# EAGLE design CHESCN.PCB (EAGLE 6.6.0)
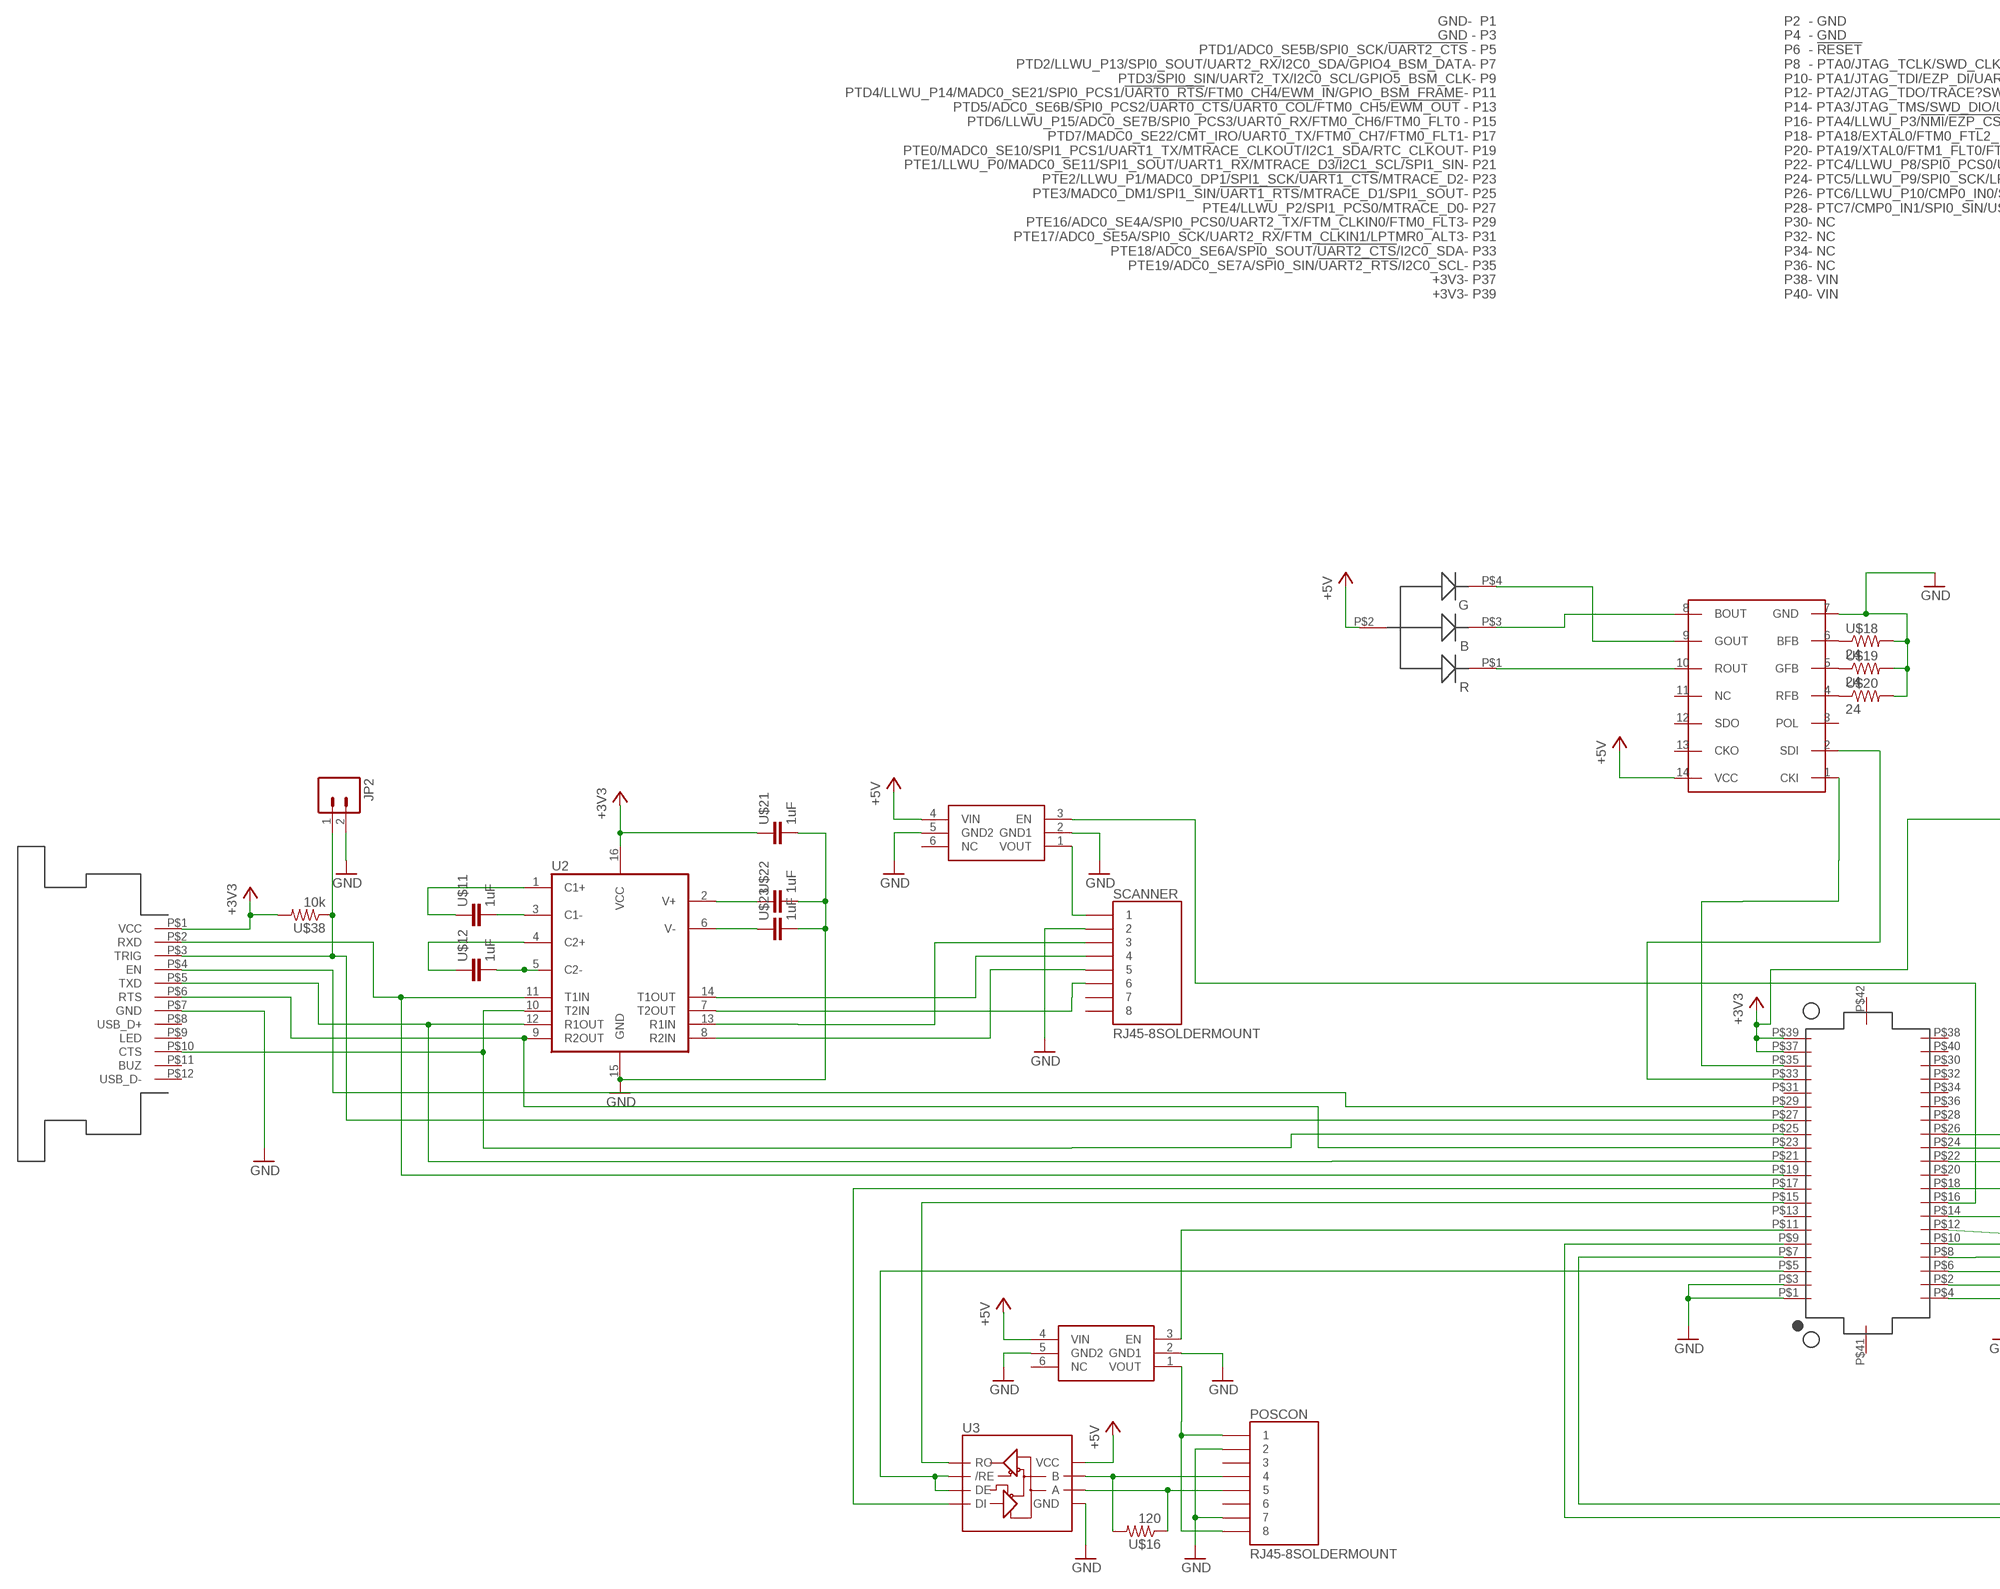
[diagram p0: schematic, sheet 1, part 1 of 2]
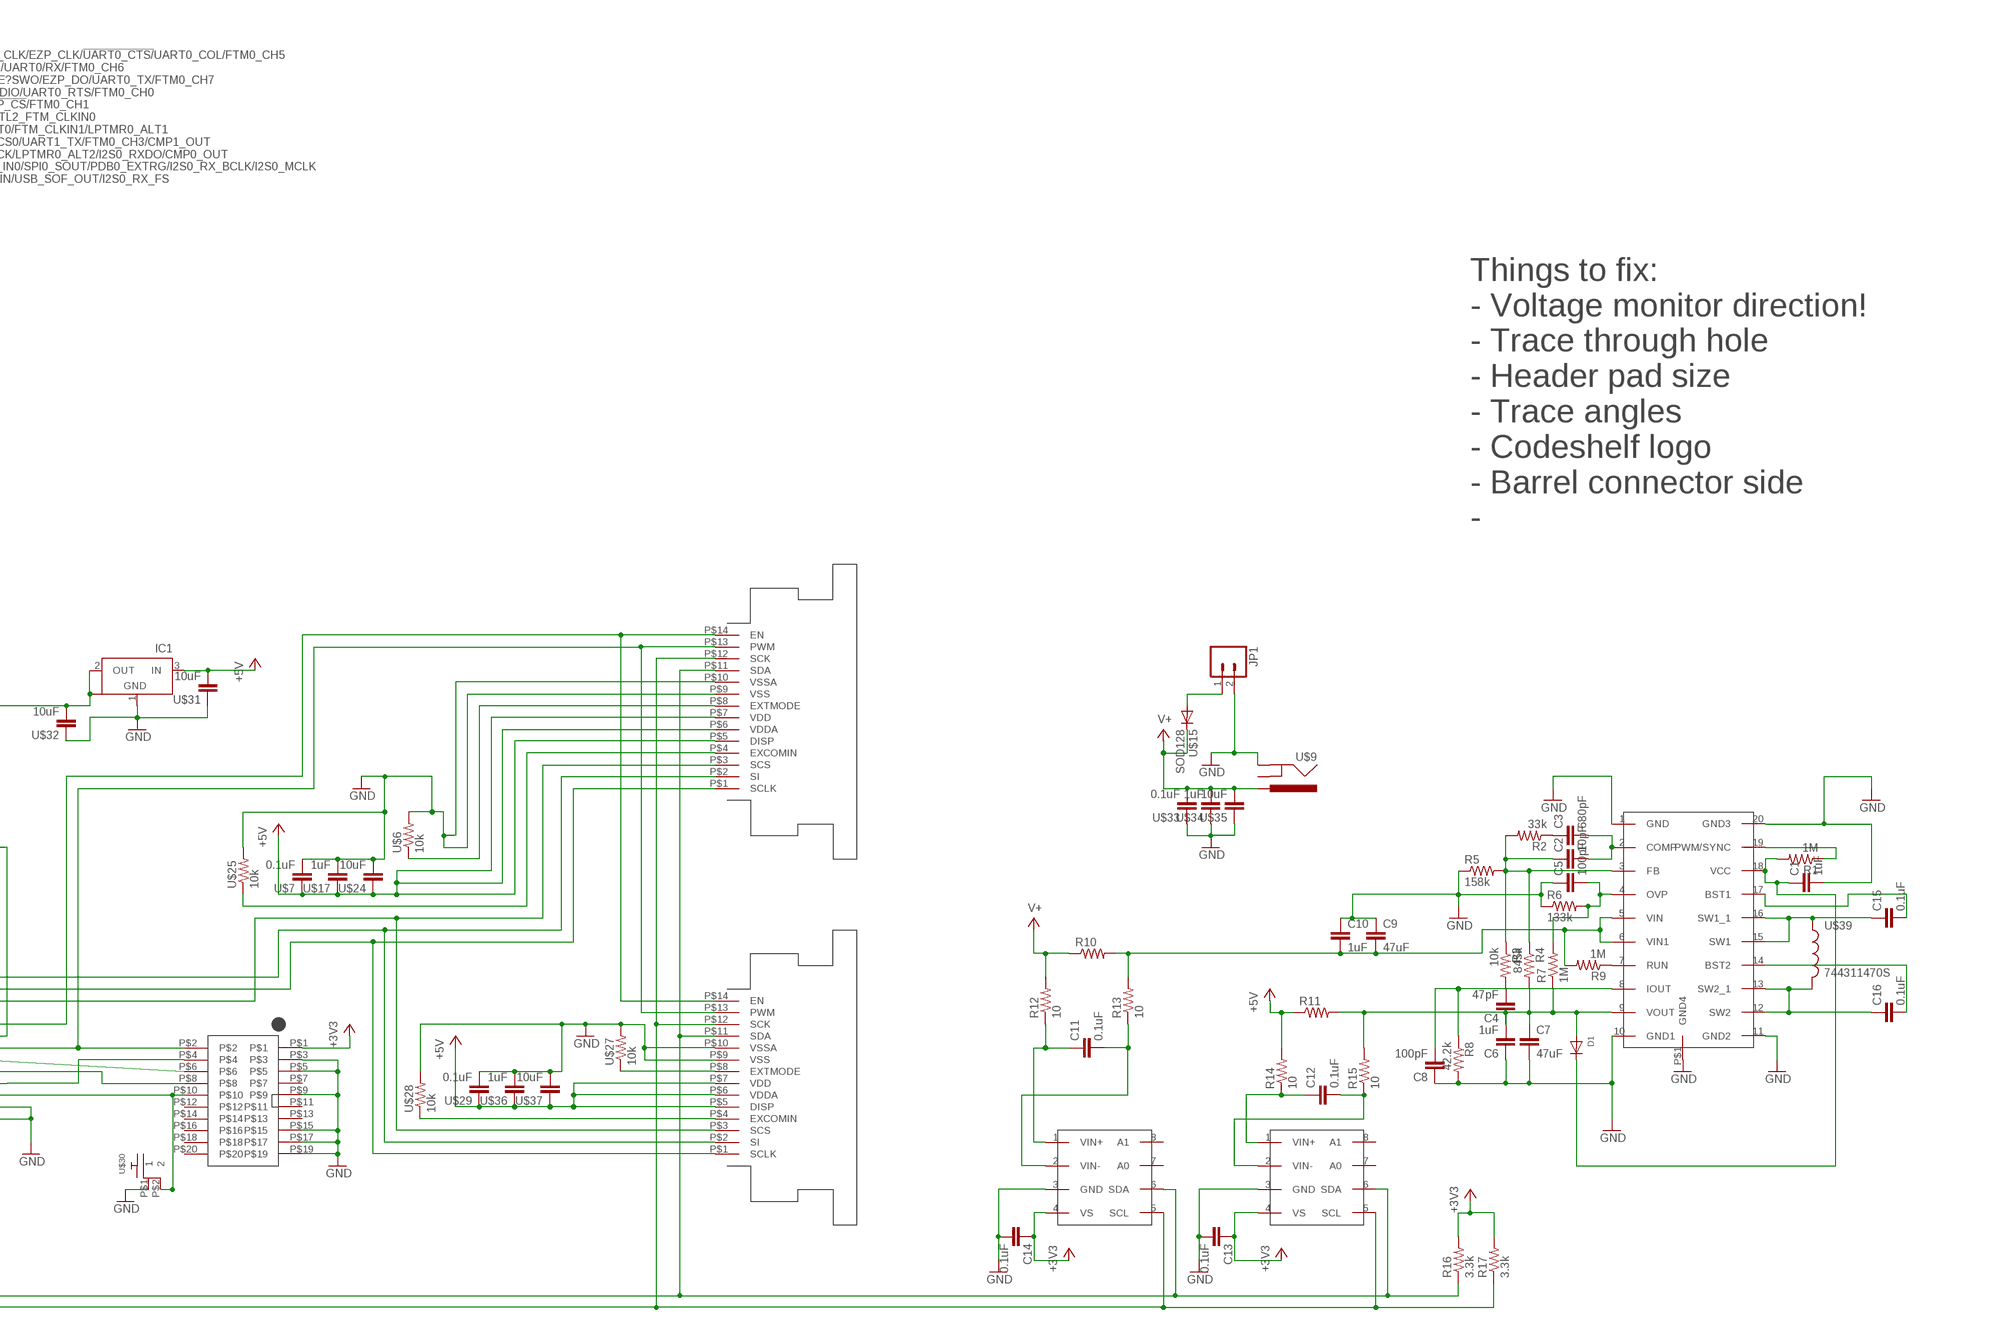
[diagram p1: schematic, sheet 1, part 2 of 2]

## Parts
C1  1uF  RF-C0603  [C0603]
C2  10pF  RF-C0402  [C0402]
C3  680pF  RF-C0402  [C0402]
C4  47pF  RF-C0402  [C0402]
C5  100pF  RF-C0402  [C0402]
C6  1uF  RF-C0603  [C0603]
C7  47uF  RF-C1210  [C1210K]
C8  100pF  RF-C0402  [C0402]
C9  47uF  RF-C1210  [C1210K]
C10  1uF  RF-C0603  [C0603]
C11  0.1uF  RF-C0402  [C0402]
C12  0.1uF  RF-C0402  [C0402]
C13  0.1uF  RF-C0402  [C0402]
C14  0.1uF  RF-C0402  [C0402]
C15  0.1uF  RF-C0402  [C0402]
C16  0.1uF  RF-C0402  [C0402]
D1  DIODESOD-123  [SOD-123]
IC1  NCP1117ST33T3G_1  [SOT223]
JP1  M02POGO_PIN_HOLES_ONLY  [1X02_PP_HOLES_ONLY]
JP2  M02POGO_PIN_HOLES_ONLY  [1X02_PP_HOLES_ONLY]
POSCON  RJ45-8SOLDERMOUNT  [RJLSE4208101T]
R1  1M  RF-R0402  [RF-R0402]
R2  33k  RF-R0402  [RF-R0402]
R3  10k  RF-R0402  [RF-R0402]
R4  845k  RF-R0402  [RF-R0402]
R5  158k  RF-R0402  [RF-R0402]
R6  133k  RF-R0402  [RF-R0402]
R7  1M  RF-R0402  [RF-R0402]
R8  42.2k  RF-R0402  [RF-R0402]
R9  1M  RF-R0402  [RF-R0402]
R10  RF-R2512  [R2512]
R11  RF-R2512  [R2512]
R12  10  RF-R0402  [RF-R0402]
R13  10  RF-R0402  [RF-R0402]
R14  10  RF-R0402  [RF-R0402]
R15  10  RF-R0402  [RF-R0402]
R16  3.3k  RF-R0402  [RF-R0402]
R17  3.3k  RF-R0402  [RF-R0402]
SCANNER  RJ45-8SOLDERMOUNT  [RJLSE4208101T]
U2  MAX232SOIC16  [SO016]
U3  RS485SOIC  [SO08]
U$1  RGLBED  [RGBLED]
U$2  SFV14R-2STE1HLF  [SFV14R-2STE1HLF]
U$3  2X10JTAG  [2X10JTAG]
U$4  MIC94061C6  [SC70-6L]
U$5  MIC94061C6  [SC70-6L]
U$6  10k  RF-R0402  [RF-R0402]
U$7  0.1uF  RF-C0402  [C0402]
U$8  WS2801  [SO14]
U$9  BARREL_CUI_PJ-002A  [BARREL_CUI_PJ-002A]
U$10  DF12_FOLD  [BRAIN_OLD]
U$11  1uF  RF-C0402  [C0402]
U$12  1uF  RF-C0402  [C0402]
U$14  SFV14R-2STE1HLF  [SFV14R-2STE1HLF]
U$15  SOD128  [SOD128]
U$16  120  RF-R0402  [RF-R0402]
U$17  1uF  RF-C0402  [C0402]
U$18  24  RF-R0402  [RF-R0402]
U$19  24  RF-R0402  [RF-R0402]
U$20  24  RF-R0402  [RF-R0402]
U$21  1uF  RF-C0402  [C0402]
U$22  1uF  RF-C0402  [C0402]
U$23  1uF  RF-C0402  [C0402]
U$24  10uF  RF-C0805  [C0805]
U$25  10k  RF-R0402  [RF-R0402]
U$26  SFV12R-1STE1HLF  [SFV12R-1STE1HLF]
U$27  10k  RF-R0402  [RF-R0402]
U$28  10k  RF-R0402  [RF-R0402]
U$29  0.1uF  RF-C0402  [C0402]
U$30  RA_BUTTON  [RA_BUTTON]
U$31  10uF  RF-C0805  [C0805]
U$32  10uF  RF-C0805  [C0805]
U$33  0.1uF  RF-C0402  [C0402]
U$34  1uF  RF-C0402  [C0402]
U$35  10uF  RF-C0805  [C0805]
U$36  1uF  RF-C0402  [C0402]
U$37  10uF  RF-C0805  [C0805]
U$38  10k  RF-R0402  [RF-R0402]
U$39  744311470S  [IHLP4040DZ]
U$44  LTC3112  [TSSOP20]
U$45  INA219B  [DCN-R-PDSO-G8]
U$46  INA219B  [DCN-R-PDSO-G8]

## Nets
+3V3: C13.1 C14.1 IC1.2(OUT) IC1.4(OUT1) R16.2 R17.2 U2.16(VCC) U$3.P$1 U$10.P$37(+3V3) U$10.P$39(+3V3) U$21.1 U$26.P$1(VCC) U$32.2 U$38.2 U$45.4(VS) U$46.4(VS)
+5V: IC1.3(IN) R11.1 R14.2 U3.8(VCC) U$1.P$2(ANODE) U$2.P$5(DISP) U$2.P$6(VDDA) U$2.P$7(VDD) U$4.4(VIN) U$5.4(VIN) U$7.1 U$8.14(VCC) U$14.P$5(DISP) U$14.P$6(VDDA) U$14.P$7(VDD) U$17.1 U$24.1 U$29.1 U$31.2 U$36.1 U$37.1
C1: U2.1(C1+) U$11.1
C2: U2.4(C2+) U$12.1
GND [GND]: C1.2 C5.1 C6.1 C7.2 C8.1 C9.1 C10.1 C13.2 C14.2 IC1.1(GND) JP1.2 JP2.2 POSCON.P$2 POSCON.P$7 R5.1 R6.1 R8.2 SCANNER.P$2 U2.15(GND) U3.5(GND) U$2.P$9(VSS) U$2.P$10(VSSA) U$3.P$3 U$3.P$5 U$3.P$9 U$3.P$15 U$3.P$17 U$3.P$19 U$4.2(GND1) U$4.5(GND2) U$5.2(GND1) U$5.5(GND2) U$6.2 U$7.2 U$8.7(GND) U$9.P$2(GND) U$10.P$1(GND) U$10.P$2(GND) U$10.P$3(GND) U$10.P$4(GND) U$14.P$9(VSS) U$14.P$10(VSSA) U$17.2 U$18.2 U$19.2 U$20.2 U$21.2 U$22.2 U$23.2 U$24.2 U$25.2 U$26.P$7(GND) U$27.2 U$28.2 U$29.2 U$30.P$1 U$31.1 U$32.1 U$33.1 U$34.1 U$35.1 U$36.2 U$37.2 U$44.1(GND) U$44.10(GND1) U$44.11(GND2) U$44.20(GND3) U$44.P$1(GND4) U$45.3(GND) U$46.3(GND)
N$1: U$2.P$13(PWM) U$3.P$2 U$10.P$14(PTA3/JTAG_TMS/SWD_DIO/UART0_RTS/FTM0_CH0) U$14.P$13(PWM)
N$2: U$3.P$6 U$10.P$12(PTA2/JTAG_TDO/TRACE?SWO/EZP_DO/UART0_TX/FTM0_CH7)
N$3: U$3.P$8 U$10.P$10(PTA1/JTAG_TDI/EZP_DI/UART0/RX/FTM0_CH6)
N$4: U$3.P$4 U$10.P$8(PTA0/JTAG_TCLK/SWD_CLK/EZP_CLK/!UART0_CTS/!UART0_COL/FTM0_CH5)
N$5: U$1.P$4(GREEN) U$8.9(GOUT)
N$6: U$3.P$10 U$10.P$6(!RESET) U$30.P$2
N$7: SCANNER.P$6 U2.7(T2OUT)
N$8: U$1.P$3(BLUE) U$8.8(BOUT)
N$9: U$1.P$1(RED) U$8.10(ROUT)
N$10 [GND]: U2.12(R1OUT) U$10.P$21(PTE1/LLWU_P0/MADC0_SE11/SPI1_SOUT/UART1_RX/MTRACE_D3/I2C1_SCL/SPI1_SIN) U$26.P$5(TXD)
N$11: U$8.1(CKI) U$10.P$35(PTE19/ADC0_SE7A/SPI0_SIN/!UART2_RTS!/I2C0_SCL)
N$12 [GND]: SCANNER.P$4 U2.14(T1OUT)
N$13: U$8.6(BFB) U$18.1
N$14: U$8.5(GFB) U$19.1
N$15: U$8.4(RFB) U$20.1
N$16: U$8.2(SDI) U$10.P$33(PTE18/ADC0_SE6A/SPI0_SOUT/!UART2_CTS!/I2C0_SDA)
N$17 [GND]: U3.1(RO) U$10.P$15(PTD6/LLWU_P15/ADC0_SE7B/SPI0_PCS3/UART0_RX/FTM0_CH6/FTM0_FLT0)
N$18: U2.3(C1-) U$11.2
N$19: POSCON.P$4 U3.7(B) U$16.2
N$20: POSCON.P$5 U3.6(A) U$16.1
N$21: U2.5(C2-) U$12.2
N$22: U2.6(V-) U$23.1
N$23: U2.2(V+) U$22.1
N$24: POSCON.P$1 POSCON.P$8 U$5.1(VOUT)
N$25 [GND]: SCANNER.P$1 U$4.1(VOUT)
N$26 [GND]: U2.11(T1IN) U$10.P$19(PTE0/MADC0_SE10/SPI1_PCS1/UART1_TX/MTRACE_CLKOUT/I2C1_SDA/RTC_CLKOUT) U$26.P$2(RXD)
N$27 [GND]: U3.4(DI) U$10.P$17(PTD7/MADC0_SE22/CMT_IRO/UART0_TX/FTM0_CH7/FTM0_FLT1)
N$28 [GND]: U3.2(/RE) U3.3(DE) U$10.P$5(PTD1/ADC0_SE5B/SPI0_SCK/!UART2_CTS)
N$29 [GND]: U$2.P$2(SI) U$10.P$26(PTC6/LLWU_P10/CMP0_IN0/SPI0_SOUT/PDB0_EXTRG/I2S0_RX_BCLK/I2S0_MCLK) U$14.P$2(SI)
N$30 [GND]: U$2.P$1(SCLK) U$10.P$24(PTC5/LLWU_P8/SPI0_PCS0/UART1_TX/FTM0_CH3/CMP1_OUT) U$14.P$1(SCLK)
N$31 [GND]: U$2.P$3(SCS) U$10.P$22(PTC4/LLWU_P8/SPI0_PCS0/UART1_TX/FTM0_CH3/CMP1_OUT) U$14.P$3(SCS)
N$32: C15.1 U$39.P$1 U$44.15(SW1) U$44.16(SW1_1)
N$33 [GND]: U$2.P$4(EXCOMIN) U$25.1
N$34 [GND]: U$2.P$8(EXTMODE) U$6.1
N$35: C16.1 U$39.P$2 U$44.12(SW2) U$44.13(SW2_1)
N$36: C16.2 U$44.14(BST2)
N$37: C15.2 U$44.17(BST1)
N$38: C2.2 C3.2 U$44.2(COMP)
N$39: U$5.3(EN) U$10.P$11(PTD4/LLWU_P14/MADC0_SE21/SPI0_PCS1/!UART0_RTS!/FTM0_CH4/EWM_IN/GPIO_BSM_FRAME)
N$40: U$4.3(EN) U$10.P$16(PTA4/LLWU_P3/!NMI!/!EZP_CS!/FTM0_CH1)
N$41: U2.10(T2IN) U$10.P$25(PTE3/MADC0_DM1/SPI1_SIN/!UART1_RTS!/MTRACE_D1/SPI1_SOUT) U$26.P$10(CTS)
N$42: C3.1 R2.1
N$43: C1.1 D1.C R1.2 U$44.18(VCC)
N$44: R1.1 U$44.19(PWM/SYNC)
N$45: C2.1 R2.2 R3.1 R4.1 R5.2 U$44.3(FB)
N$46: C4.2 R3.2
N$47: C9.2 C10.2 R9.2 R10.2 R13.2 U$44.5(VIN) U$44.6(VIN1)
N$48: C4.1 C6.2 C7.1 D1.A R4.2 R7.1 R11.2 R15.2 U$44.9(VOUT)
N$49: C5.2 R6.2 R7.2 U$44.4(OVP)
N$50: R9.1 U$44.7(RUN)
N$51: C8.2 R8.1 U$44.8(IOUT)
N$52: SCANNER.P$5 U2.8(R2IN)
N$53: C11.1 R12.1 U$45.1(VIN+)
N$54: U2.9(R2OUT) U$10.P$23(PTE2/LLWU_P1/MADC0_DP1/SPI1_SCK/!UART1_CTS!/MTRACE_D2) U$26.P$6(RTS)
N$55: C11.2 R13.1 U$45.2(VIN-)
N$56: C12.1 R14.1 U$46.1(VIN+)
N$57: C12.2 R15.1 U$46.2(VIN-)
N$58: R16.1 U$2.P$11(SDA) U$10.P$7(PTD2/LLWU_P13/SPI0_SOUT/UART2_RX/I2C0_SDA/GPIO4_BSM_DATA) U$14.P$11(SDA) U$45.6(SDA) U$46.6(SDA)
N$59: R17.1 U$2.P$12(SCK) U$10.P$9(PTD3/SPI0_SIN/UART2_TX/I2C0_SCL/GPIO5_BSM_CLK) U$14.P$12(SCK) U$45.5(SCL) U$46.5(SCL)
N$60: JP2.1 U$10.P$27(PTE4/LLWU_P2/SPI1_PCS0/MTRACE_D0) U$26.P$3(TRIG) U$38.1
N$61: U$2.P$14(EN) U$10.P$18(PTA18/EXTAL0/FTM0_FTL2_FTM_CLKIN0) U$14.P$14(EN)
N$62: U$10.P$29(PTE16/ADC0_SE4A/SPI0_PCS0/UART2_TX/FTM_CLKIN0/FTM0_FLT3) U$26.P$4(EN)
N$63 [GND]: U$14.P$4(EXCOMIN) U$28.1
N$64: U$14.P$8(EXTMODE) U$27.1
N$65: JP1.1 U$15.P$2(A)
R1IN: SCANNER.P$3 U2.13(R1IN)
V+: R10.1 R12.2 U$9.P$1(PWR) U$15.P$1(C) U$33.2 U$34.2 U$35.2
Unconnected: POSCON.P$3 POSCON.P$6 SCANNER.P$7 SCANNER.P$8 U$3.P$7 U$3.P$11 U$3.P$12 U$3.P$13 U$3.P$14 U$3.P$16 U$3.P$18 U$3.P$20 U$4.6(NC) U$5.6(NC) U$8.3(POL) U$8.11(NC) U$8.12(SDO) U$8.13(CKO) U$9.P$3(GNDBREAK) U$10.P$13(PTD5/ADC0_SE6B/SPI0_PCS2/!UART0_CTS!/!UART0_COL!/FTM0_CH5/!EWM_OUT) U$10.P$20(PTA19/XTAL0/FTM1_FLT0/FTM_CLKIN1/LPTMR0_ALT1) U$10.P$28(PTC7/CMP0_IN1/SPI0_SIN/USB_SOF_OUT/I2S0_RX_FS) U$10.P$30(NC) U$10.P$31(PTE17/ADC0_SE5A/SPI0_SCK/UART2_RX/FTM_CLKIN1/LPTMR0_ALT3) U$10.P$32(NC) U$10.P$34(NC) U$10.P$36(NC) U$10.P$38(VIN) U$10.P$40(VIN) U$10.P$41 U$10.P$42 U$26.P$8(USB_D+) U$26.P$9(LED) U$26.P$11(BUZ) U$26.P$12(USB_D-) U$45.7(A0) U$45.8(A1) U$46.7(A0) U$46.8(A1)

## Notes on the sheet
- Things to fix:
  - Voltage monitor direction!
  - Trace through hole
  - Header pad size
  - Trace angles
  - Codeshelf logo
  - Barrel connector side
  -

## Library data of the parts
C1-C16 U$7 U$17 U$29 U$33 U$34 U$36 = GW-devices:RF-C: RF capacitor pads for FSL reference design
D1 = adafruit:DIODE: Diode SMADIODE - SMA Surface Mount Package 20V 1A Schottky Diode Digikey: 641-1014-6-ND DO-1N4148 - Through Hole Small Current Diode SOD-123 20V 1 A (.5mV Vf) Schottky Diode - Digikey: MBRX120TPMSCT-ND SOD-323 10V 570mA (.38mV Vf, 3ns) Schottky Diode - Digikey: ZLLS410CT-ND SOD-523 30V 30mA Schottky Diode (RB751S-40TE61) - Digikey: RB751S-40TE61CT-ND SOT23-R/W - SOT23 Package (R = Solder Paste/Reflow Ovens, W = Hand-Soldering) BAT54Film 40V 300mA - Digikey: 497-7162-1-ND
IC1 = KW2:NCP1117ST33T3G_1: VOLTAGE REGULATOR; MFGN: OnSemi; MFGP: NCP1117ST33T3G
JP1 JP2 = SparkFun:M02: Header 2 Standard 2-pin 0.1" header. Use with straight break away headers (SKU : PRT-00116), right angle break away headers (PRT-00553), swiss pins (PRT-00743), machine pins (PRT-00117), and female headers (PRT-00115). Molex polarized connector foot print use with SKU : PRT-08233 with associated crimp pins and housings.
POSCON SCANNER = GW-devices:RJ45-8: RJ45 Jack MFG part number 54602-908lf
R1-R17 U$6 U$25 U$27 U$28 U$38 = GW-devices:RF-R: RF resistor pads for FSL reference design
U2 = SparkFun:MAX232: RS232 Transceiver Very common IC. This is generically called 'MAX232', but works with the 3V equivalent MAX3232 generic ICs. Field tested and mother approved. Spark Fun Electronics SKU : COM-00316 (DIP) and COM-00589 (SMD); MFGN: Texas Instruments; MFGP: MAX232DR; PRICE: 0.86
U3 = SparkFun:RS485; MFGN: Texas Instruments; MFGP: SN65HVD1781DR; PRICE: 4.29
U$1 = KW2:RGLBED
U$2 U$14 = KW2:SFV14R-2STE1HLF
U$3 = KW2:2X10JTAG
U$4 U$5 = GW-devices:MIC94061; MFGN: Micrel; MFGP: MIC94061YC6 TR; PRICE: 1.50
U$8 = GW-devices:WS2801
U$9 = KW2:BARREL_CUI_PJ-002A
U$10 = KW2:DF12_F
U$11 U$12 U$21-U$23 = GW-devices:RF-C: RF capacitor pads for FSL reference design; MFGN: TDK; MFGP: C2012X5R1E105K125AA
U$15 = KW2:SOD128
U$16 = GW-devices:RF-R: RF resistor pads for FSL reference design; MFGN: Vishay Dale; MFGP: CRCW080510K0FKEA
U$18-U$20 = GW-devices:RF-R: RF resistor pads for FSL reference design; MFGN: Vishay Dale; MFGP: CRCW080524R0FKEA
U$24 U$31 U$32 U$35 U$37 = GW-devices:RF-C: RF capacitor pads for FSL reference design; MFGN: Murata; MFGP: GRM219R61E106KA12D
U$26 = KW2:SFV12R-1STE1HLF
U$30 = KW2:RA_BUTTON
U$39 = KW2:744311470
U$44 = linear-technology:LTC3112
U$45 U$46 = texas:INA219B

## Board
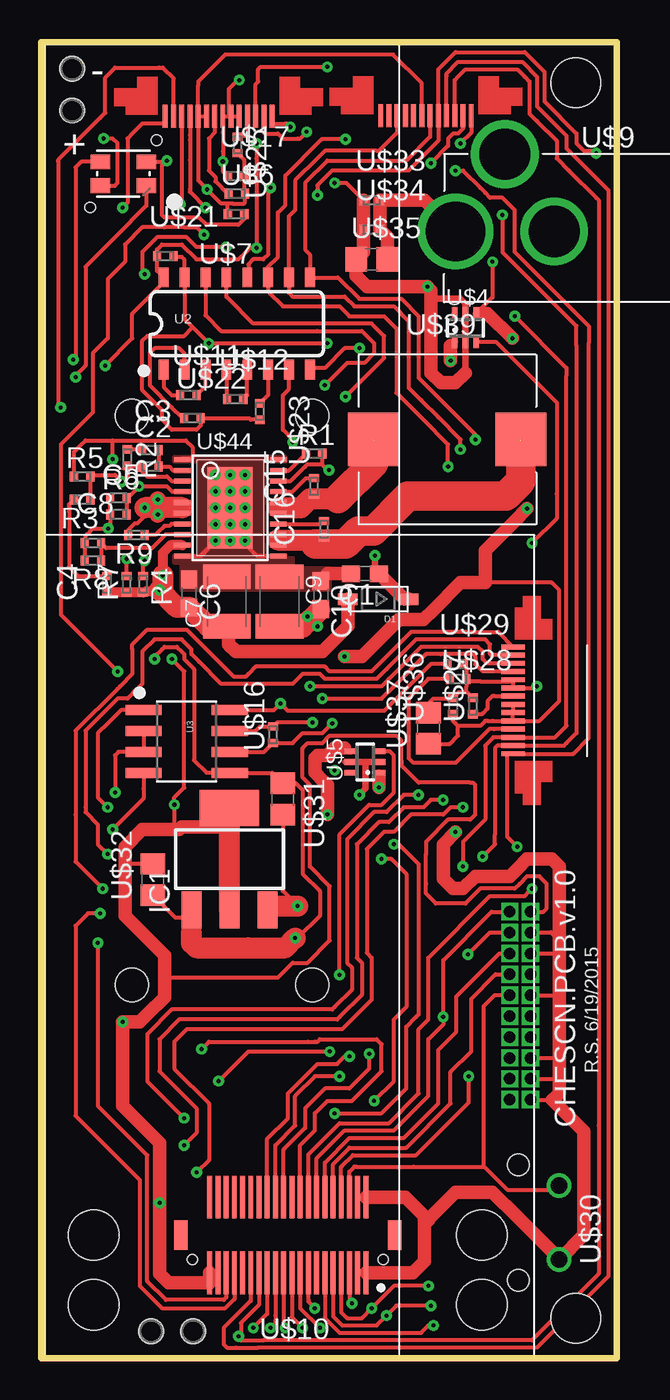
[diagram p2: board, top side]
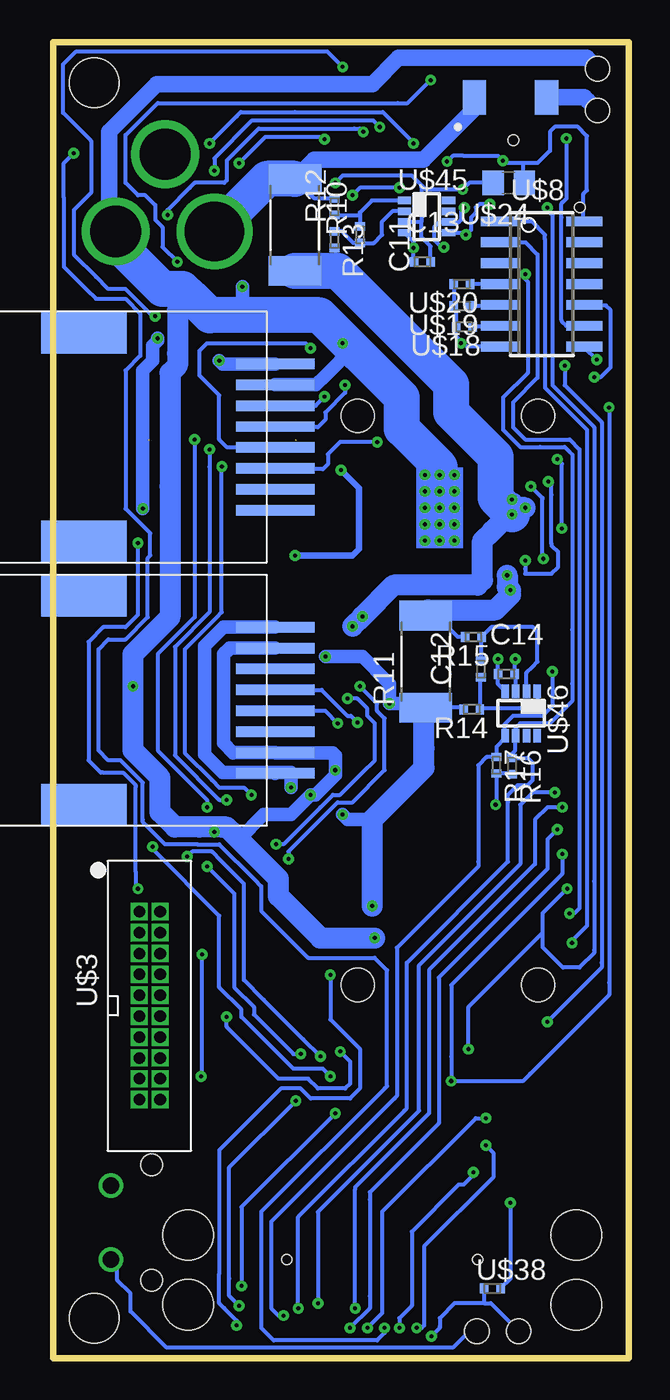
[diagram p3: board, bottom side, seen from below]

Size 35 x 80 mm. Coordinates in mm from the lower left corner, seen from the top.
Outline: 0,80 35,80 35,0 0,0 0,80
Copper layers (1*16): Top 0.035mm / dielectric 1.5mm / Bottom 0.035mm
Design rules "default *": minimum track width 10mil, minimum drill 24mil, track to track 0.15mm, track to pad 0.15mm, pad to pad 0.15mm, via to via 0.15mm, smd to smd 0.15mm, copper to edge 40mil, drill to drill 8mil, minimum pad ring 2mil, minimum via ring 8mil, stop-mask expansion 4mil, vias tented up to drill 0.26mm, thermal gap 10mil
Holes 3.05 mm at 26.8,7.5 3.2,7.5
Holes 3 mm at 32.5,77.55 32.5,2.45

### Footprints (pad centres in the part's own frame; a part is rotated, then mirrored left to right if it is on the bottom)
C0603 = smd 1.1 x 1: 1 -0.85,0; 2 0.85,0
C0402 = smd 0.5 x 0.6: 1 -0.5,0; 2 0.5,0
C1210K = smd 1.5 x 2.9: 1 -1.5,0; 2 1.5,0
SOD-123 = smd 1.2 x 0.7: A 1.85,0; C -1.85,0
SOT223 = smd 1.219 x 2.235: 1 -2.311,-3.099; 2 0,-3.099; 3 2.311,-3.099 | smd 3.6 x 2.2: 4 0,3.099
1X02_PP_HOLES_ONLY = drill 0.889 pad 0.813: 1 0,0; 2 2.54,0 | hole 1.473: 0,0; 2.54,0
RJLSE4208101T = smd 0.635 x 4.75: P$1 -4.445,0; P$2 -3.175,0; P$3 -1.905,0; P$4 -0.635,0; P$5 0.635,0; P$6 1.905,0; P$7 3.175,0; P$8 4.445,0 | smd 2.54 x 5.207: P$9 -6.35,-11.633; P$10 6.35,-11.633
RF-R0402 = smd 0.5 x 0.6: 1 -0.5,0; 2 0.5,0
R2512 = smd 1.8 x 3.2: 1 -2.8,0; 2 2.8,0
SO016 = smd 0.6 x 1.2: 1 -4.445,-2.8; 2 -3.175,-2.8; 3 -1.905,-2.8; 4 -0.635,-2.8; 5 0.635,-2.8; 6 1.905,-2.8; 7 3.175,-2.8; 8 4.445,-2.8; 9 4.445,2.8; 10 3.175,2.8; 11 1.905,2.8; 12 0.635,2.8; 13 -0.635,2.8; 14 -1.905,2.8; 15 -3.175,2.8; 16 -4.445,2.8
SO08 = smd 0.61 x 2.21: 1 -1.905,-2.616; 2 -0.635,-2.616; 3 0.635,-2.616; 4 1.905,-2.616; 5 1.905,2.616; 6 0.635,2.616; 7 -0.635,2.616; 8 -1.905,2.616
RGBLED = smd 1.2 x 0.9: P$1 1.4,-0.725; P$2 1.4,0.725; P$3 -1.4,0.725; P$4 -1.4,-0.725 | hole 0.61: 2.019,2.045; -2.019,-2.045
SFV14R-2STE1HLF = smd 0.3 x 1.4: P$1 -3.25,0; P$2 -2.75,0; P$3 -2.25,0; P$4 -1.75,0; P$5 -1.25,0; P$6 -0.75,0; P$7 -0.25,0; P$8 0.25,0; P$9 0.75,0; P$10 1.25,0; P$11 1.75,0; P$12 2.25,0; P$13 2.75,0; P$14 3.25,0
2X10JTAG = drill 0.7 pad 1 square: P$1 -6.35,-1.27; P$2 -6.35,0; P$3 -5.08,-1.27; P$4 -5.08,0; P$5 -3.81,-1.27; P$6 -3.81,0; P$7 -2.54,-1.27; P$8 -2.54,0; P$9 -1.27,-1.27; P$10 -1.27,0; P$11 0,-1.27; P$12 0,0; P$13 1.27,-1.27; P$14 1.27,0; P$15 2.54,-1.27; P$16 2.54,0; P$17 3.81,-1.27; P$18 3.81,0; P$19 5.08,-1.27; P$20 5.08,0
SC70-6L = smd 0.35 x 0.8: 1 -0.65,-0.85; 2 0,-0.85; 3 0.65,-0.85; 4 0.65,0.85; 5 0,0.85; 6 -0.65,0.85
SO14 = smd 0.6 x 2.2: 1 -3.81,-2.6; 2 -2.54,-2.6; 3 -1.27,-2.6; 4 0,-2.6; 5 1.27,-2.6; 6 2.54,-2.6; 7 3.81,-2.6; 8 3.81,2.6; 9 2.54,2.6; 10 1.27,2.6; 11 0,2.6; 12 -1.27,2.6; 13 -2.54,2.6; 14 -3.81,2.6
BARREL_CUI_PJ-002A = drill 3.6: P$1 0,0 | drill 3.1: P$2 6,0; P$3 3,4.7
BRAIN_OLD = smd 0.3 x 2.6: P$1 -4.75,2.3; P$2 -4.75,-2.3; P$3 -4.25,2.3; P$4 -4.25,-2.3; P$5 -3.75,2.3; P$6 -3.75,-2.3; P$7 -3.25,2.3; P$8 -3.25,-2.3; P$9 -2.75,2.3; P$10 -2.75,-2.3; P$11 -2.25,2.3; P$12 -2.25,-2.3; P$13 -1.75,2.3; P$14 -1.75,-2.3; P$15 -1.25,2.3; P$16 -1.25,-2.3; P$17 -0.75,2.3; P$18 -0.75,-2.3; P$19 -0.25,2.3; P$20 -0.25,-2.3; P$21 0.25,2.3; P$22 0.25,-2.3; P$23 0.75,2.3; P$24 0.75,-2.3; P$25 1.25,2.3; P$26 1.25,-2.3; P$27 1.75,2.3; P$28 1.75,-2.3; P$29 2.25,2.3; P$30 2.25,-2.3; P$31 2.75,2.3; P$32 2.75,-2.3; P$33 3.25,2.3; P$34 3.25,-2.3; P$35 3.75,2.3; P$36 3.75,-2.3; P$37 4.25,2.3; P$38 4.25,-2.3; P$39 4.75,2.3; P$40 4.75,-2.3 | smd 0.8 x 1.8: P$41 -6.5,0; P$42 6.5,0 | hole 0.6: -5.8,1.5; 5.8,1.5 | hole 3.048: -11.8,4.24; 11.8,4.24
18650_1S1P = hole 2: -5.475,17.3; 5.475,17.3; 5.475,-17.3; -5.475,-17.3
SOD128 = smd 1.4 x 2.1: P$1 -2.2,0; P$2 2.2,0
C0805 = smd 1.3 x 1.5: 1 -0.95,0; 2 0.95,0
SFV12R-1STE1HLF = smd 0.3 x 1.4: P$1 -2.75,1.27; P$2 -2.25,1.27; P$3 -1.75,1.27; P$4 -1.25,1.27; P$5 -0.75,1.27; P$6 -0.25,1.27; P$7 0.25,1.27; P$8 0.75,1.27; P$9 1.25,1.27; P$10 1.75,1.27; P$11 2.25,1.27; P$12 2.75,1.27
RA_BUTTON = drill 0.99: P$1 -2.25,0; P$2 2.25,0 | hole 1.3: -3.501,2.49; 3.501,2.49
IHLP4040DZ = smd 3.124 x 3.251: P$1 -4.471,0; P$2 4.471,0
TSSOP20 = smd 0.305 x 0.991: 1 -2.925,-2.918; 2 -2.275,-2.918; 3 -1.625,-2.918; 4 -0.975,-2.918; 5 -0.325,-2.918; 6 0.325,-2.918; 7 0.975,-2.918; 8 1.625,-2.918; 9 2.275,-2.918; 10 2.925,-2.918; 11 2.925,2.918; 12 2.275,2.918; 13 1.625,2.918; 14 0.975,2.918; 15 0.325,2.918; 16 -0.325,2.918; 17 -0.975,2.918; 18 -1.625,2.918; 19 -2.275,2.918; 20 -2.925,2.918 | smd 4.95 x 2.74: P$1 0,0
DCN-R-PDSO-G8 = smd 0.45 x 0.8: 1 -0.975,-1.35; 2 -0.325,-1.35; 3 0.325,-1.35; 4 0.975,-1.35; 5 0.975,1.35; 6 0.325,1.35; 7 -0.325,1.35; 8 -0.975,1.35

### Placement (x,y rotation side)
C1  19.7,47.7 180 top
C2  6.65,54.2 0 top
C3  6.65,55.2 0 top
C4  4,47.05 90 top
C5  4.7,51.3 0 top
C6  9,46.5 270 top
C7  11.3,46 90 top
C8  3.15,49.55 0 top
C9  14.5,46 270 top
C10  17,46.4 270 top
C11  16.35,68.3 270 bottom
C12  9,41.9 90 bottom
C13  12.55,66.65 0 bottom
C14  7.45,41.6 0 bottom
C15  16.6,53 90 top
C16  17.2,50.4 90 top
D1  20.5,46.15 180 top
IC1  11.45,30.35 0 top
JP1  1.9,75.85 90 top
JP2  6.7,1.65 0 top
POSCON  21.5,40 270 bottom
R1  16.6,55 0 top
R2  5.25,54.75 270 top
R3  2.5,52.2 180 top
R4  6.2,47.05 270 top
R5  2.5,53.6 0 top
R6  4.7,52.3 0 top
R7  5.2,47.05 90 top
R8  3.15,48.5 180 top
R9  5.8,50.05 180 top
R10  20.3,68.9 270 bottom
R11  12.35,42.35 90 bottom
R12  17.9,70 90 bottom
R13  17.9,68 270 bottom
R14  9.55,39.45 180 bottom
R15  9.45,43.85 180 bottom
R16  7.1,36 270 bottom
R17  8.05,36.05 270 bottom
SCANNER  21.5,56 270 bottom
U2  11.9,62.9 0 top
U3  8.85,37.5 270 top
U$1  5,72 0 top
U$2  10.8,75.5 180 top
U$3  28.5,20.8 270 bottom
U$4  25.8,62.65 0 top
U$5  19.7,36.25 90 top
U$6  11.9,70.8 0 top
U$7  11.85,69.55 180 top
U$8  5.3,65.3 270 bottom
U$9  25.2,68.5 0 top
U$10  15,7.5 180 top
U$11  8.95,58.55 0 top
U$12  11.8,58.3 0 top
U$13  [18650_1S1P]  11,40 0 top
U$14  28.7,40 90 top
U$15  7.2,76.65 0 bottom
U$16  14.1,37.9 90 top
U$17  11.85,71.85 0 top
U$18  10,62.7 180 bottom
U$19  10.15,63.95 180 bottom
U$20  10.15,65.3 180 bottom
U$21  7.55,67 0 top
U$22  9.2,57.15 0 top
U$23  13.3,57.55 270 top
U$24  7.3,71.45 180 bottom
U$25  11.95,73.75 270 top
U$26  23.4,76.8 180 top
U$27  26.25,39.65 90 top
U$28  25.35,41.3 0 top
U$29  25.2,42.2 0 top
U$30  31.5,8.25 90 top
U$31  14.7,34 270 top
U$32  6.8,29.1 90 top
U$33  20.1,70.4 0 top
U$34  20.1,68.6 0 top
U$35  20.1,66.8 0 top
U$36  25.05,39.65 90 top
U$37  23.55,38.3 90 top
U$38  8.3,4.25 0 bottom
U$39  24.7,55.85 0 top
U$44  11.5,51.7 270 top
U$45  12.3,69.4 270 bottom
U$46  6.55,39.2 180 bottom

### Tracks (layer width: path | path; a pad name or v marks a point on that pad's centre or on a via)
+3V3  (via drill 0.25)
  Top 0.254: U$10.P$37 U$10.P$39 | U$21.1 7.05,66.8 | v13.1,73.85 13.1,72.95 13.1,71.9 13.1,71.7 v13.1,67.5 12.7,67.5 12.45,67.25 12,66.8 9.45,66.8 8.55,67.7 7.35,67.7 7.05,67.4 U$21.1 | 8.25,32 8.1,32.15 v8.1,33.65 8.1,34.1 8.7,34.7 8.7,41.75 v7.95,42.5 | U$32.2 5.33,30.05 5.25,30.05 5.1,29.9 | U$3.P$1 30.55,27.15 30.75,27.35 30.75,28.85 30.3,29.3 29.55,29.3 29.1,28.85 28.8,28.55 26.7,28.55 26.4,28.25 25.8,27.65 24,27.65 23.4,28.25 23.4,28.85 23.4,30.65 23.4,31.4 24.75,32.75 26.1,32.75 26.4,33.05 26.4,34.85 26.25,35 26.1,35 22.95,35 21.9,36.05 21.9,36.35 21.9,37.55 21.82,37.62 21.6,37.85 17.55,37.85 17.1,37.4 16.2,37.4 15.9,37.1 15.9,35.3 16.35,34.85 16.35,29.9 17.55,28.7 17.55,25.4 16.2,24.05 15.3,24.05 14.4,23.15 7.5,23.15 | v3.9,60.35 5.55,62 5.55,63.5 7.46,65.41 U2.16 7.05,66.11 U$21.1 | U$26.P$1 26.15,74.5 v25.5,73.85
  Top 0.813: U$10.P$39 10.25,4.6 7.75,4.6 7.2,5.15 v7.2,9.45 7.2,13.1 4.95,15.35 v4.95,20.45 6,20.45 6.45,20.9 7.5,21.95 7.5,23.15 7.5,24.2 7.5,24.5 5.1,26.9 5.1,29.75 5.1,29.9 5.1,31.1 6.15,32.15 7.8,32.15 | 7.8,32.15 8.1,32.15 | 11.45,32.3 8.55,32.3 8.4,32.15 7.8,32.15
  Top 1.27: IC1.2 11.45,29.3 11.45,32.3 IC1.4
  Bottom 0.254: R16.2 7.15,35.55 R17.2 8.05,33.7 v8.1,33.65 | 7.95,41.58 C14.1 | U$46.4 7.95,40.98 C14.1 | C14.1 v7.95,42.5 | U$45.4 13.1,67.88 v13.1,67.5 13.1,66.7 C13.1 | v4.95,20.45 1.65,23.75 1.65,24.05 1.65,56.9 3.9,59.15 v3.9,60.35 | v25.5,73.85 23.85,75.5 23.6,75.75 20.3,75.75 14.95,75.75 14.7,75.5 13.52,74.33 13.1,73.9 v13.1,73.85 | v7.2,9.45 7.2,4.85 U$38.2
+5V  (via drill 0.25)
  Top 0.254: U$2.P$6 U$2.P$7 11.05,74.5 11.05,73.35 v11.05,72.75 11.05,72.15 U$17.1 | U$2.P$6 U$2.P$5 | U$1.P$2 7.57,72.72 v7.65,72.8 7.35,72.5 7.35,69.5 7.5,69.35 9.6,69.35 10.05,68.9 12,68.9 12.35,69.25 U$7.1 | U$14.P$7 U$14.P$6 U$14.P$5 | U$14.P$5 27.45,38.75 27.15,38.75 27,38.75 26.7,38.45 25.35,38.45 | U$14.P$5 30.3,38.75 31.5,39.95 31.5,46.7 31.05,47.15 27,47.15 | U$2.P$6 11.4,75.65 11.4,77.15 11.95,77.7 v12.05,77.7 | 25.35,38.45 25.2,38.6 25.05,38.75 U$36.1 | U$37.1 24.85,37.35 25.35,37.85 25.35,38.45 | U$29.1 23.7,42.2 21.75,40.25 20.85,39.35 17.55,39.35 15,39.35 v14.55,39.8 14.16,39.41 U3.8 | U$31.2 14.7,28.4 v15.6,27.5 | IC1.3 13.76,26.79 13.8,26.75 13.8,27.49 13.81,27.5 | v27.45,66.65 27.45,64.5 U$4.4
  Top 0.406: U$4.4 26.7,63.5 | U$5.4 18.65,36.9 18.45,37.1
  Top 0.813: v29.55,51.65 28.8,50.9 27,49.1 27,47.15 25.5,47.15 23.85,45.5 23.25,44.9 21.75,44.9 19.5,42.65 v18.45,42.65 | 17.4,34.85 17.18,35.08 | 17.18,35.08 16.65,35.6 16.65,36.5 16.8,36.65 17.4,36.65 17.55,36.8 17.85,37.1 18.45,37.1 | v17.4,33.05 17.4,34.85 | 17.4,34.85 17.18,35.08 | v28.65,62 27.15,63.5 26.7,63.5
  Top 1.27: 13.81,27.5 14.85,27.5 v15.6,27.5
  Bottom 0.254: U$8.14 2.76,69.05 2.76,70.79 2.55,71 2.55,74.3 3.1,74.85 4.5,74.85 4.8,74.55 4.8,73.4 5.55,72.65 6.45,72.65 | 6.45,72.65 7.5,72.65 v7.65,72.8 7.95,73.1 10.05,73.1 10.7,73.1 v11.05,72.75 | 6.45,72.65 6.45,71.55 U$24.1 | R14.2 10.15,39.55 R11.1 | v27.45,66.65 28.35,67.55 28.35,68.75 28.8,69.2 28.8,70.1 29.4,70.7 29.85,70.7 30.6,71.45 30.6,74.35 28.65,76.3 14.05,76.3 13.45,76.3 v12.05,77.7
  Bottom 0.813: v18.45,42.65 16.5,42.65 16.2,42.65 14.7,41.15 14.55,41 v14.55,39.8 12.6,39.8 R11.1 | v28.65,62 28.65,61.85 28.95,61.55 28.95,60.65 29.55,60.05 29.55,52.25 v29.55,51.65 | v17.4,33.05 17.1,32.75 15.6,32.75
  Bottom 1.27: v15.6,27.5 15.6,27.65 15.6,32.75 12.45,35.9 12.45,37.1 12.45,39.45 R11.1
C1
  Top 0.254: U2.1 7.46,59.05 7.95,58.55 U$11.1
C2
  Top 0.254: U$12.1 11.3,60.06 U2.4
GND  (via drill 0.25)
  Top 0.254: C5.1 R6.1 | C5.1 4.1,51.3 | R5.1 2,55.1 2.4,55.5 2.7,55.8 4.34,55.8 | 4.34,55.8 8.8,55.8 9.2,55.4 9.2,54.7 8.6,54.7 | 9.7,48.8 v10.6,49.7 | v12.4,49.7 12.4,49.5 13.1,48.8 14.39,48.8 U$44.11 | 31.5,25.25 31.5,25.4 31,25.9 29.79,25.9 U$3.P$3 | 31.2,15.8 31.1,15.7 29.79,15.7 U$3.P$19 | 31.5,18.2 31.4,18.3 31.36,18.26 U$3.P$15 | 31.5,24.5 31.4,24.6 U$3.P$5 | U$10.P$2 U$10.P$4 | U$10.P$1 U$10.P$3 | U$2.P$10 U$2.P$9 | 19.35,70.4 U$33.1 18.55,71.45 v17.85,71.45 | 8.05,66.97 U$21.2 8.1,66.95 8.55,66.95 8.73,66.78 U2.15 8.73,63.17 9.23,62.67 | U$2.P$10 9.55,71.9 9.55,71.6 v10.1,71.05 10.95,70.2 11.4,70.2 | 11.4,70.2 11.65,70.2 12.35,70.2 12.4,70.25 U$6.2 12.35,70.85 U$17.2 12.35,72.85 U$25.2 | U$7.2 11.35,70.15 11.4,70.2 | 9.23,62.67 10.13,61.78 v10.2,61.7 15.3,61.7 v17.4,61.7 | U$28.2 25.85,40.8 25.85,40.55 25.9,40.5 | 9.23,62.67 8.7,62.15 6.45,62.15 6.15,61.85 6.15,58.85 7.35,57.65 7.35,57.05 7.95,56.45 9.45,56.45 9.7,56.7 U$22.2 12.65,57.15 12.75,57.05 U$23.2 | C5.1 4.2,50.58 v4.07,50.45 3.15,50.45 3,50.3 2.7,50 2.7,49.6 C8.1 R8.2 | U$44.1 8.55,54.65 | U$3.P$17 31.5,17 | U$3.P$9 31.38,22.07 31.5,21.95 | U$27.2 25.9,40.5 | 25.9,40.5 25.4,40.5 U$36.2 25,40.1 23.85,40.1 23.55,39.8 U$37.2 | U$28.2 26,41.15 26.7,41.15 28.6,41.15 U$14.P$10 U$14.P$9 29.9,40.75 30.05,40.75 v30.15,40.85 | U$29.2 25.85,42.05 U$28.2 | U$32.1 8.15,26.8 8.69,26.8 IC1.1 arc-90 IC1.1 9.15,26.79 9.15,25.89 | v6.9,42.5 6.9,42.65 7.35,43.1 7.5,43.25 8.25,43.25 8.55,42.95 8.7,42.8 8.7,42.5 9.3,41.9 9.3,36.35 10.05,35.6 U3.5 14.05,35.59 U$31.1 15.5,34.95 15.9,34.55 15.9,29.45 16.95,28.4 16.95,26.9 15.6,25.55 v15.45,25.55
  Top 0.254: U$44.10 9.73,48.77 9.75,48.8 10.65,49.7 | v4.35,54.65 4.35,55.79 4.34,55.8 | U$2.P$10 9.55,77.4 9.55,77.6 11.2,79.25 17.9,79.25 21.4,79.25 23.15,77.5 U$26.P$7 | 23.1,8.8 23.3,8.6 23.1,8.8
  Top 0.406: 25.8,59.9 U$4.2 U$4.5 25.8,64.1 25.5,64.4 23.55,64.4 | U$5.2 19.73,36.25 | 19.73,36.25 U$5.5 18.5,36.25 | 19.73,36.25 19.73,34.63 v19.35,34.25
  Top 0.813: U$33.1 U$34.1 19.6,67.3 19.6,67.25 U$35.1 19.15,65.8 19.8,65.15 v23.5,65.15 23.5,65.1 23.7,64.9 23.7,59.9 24.3,59.3 24.9,59.3 25.2,59.3 25.8,59.9 | C1.2 17.4,47.7 | 31.2,15.8 31.5,16.1 31.5,17 31.5,18.2 31.5,21.95 31.5,22.1 31.5,24.5 31.5,25.25 31.5,29.9 31.05,30.35 29.55,30.35 28.95,29.75 28.5,29.3 26.4,29.3 25.65,28.55 25.05,28.55 24.45,29.15 24.45,31.25 v25.2,32 | U$10.P$2 22,9.8 22.15,9.8 23.55,8.4 | 23.55,8.4 23.4,8.4 23.35,8.4 23.3,8.45 | U$10.P$1 22.5,5.2 22.6,5.2 23.3,5.9 23.3,8.45 | 23.3,8.45 23.3,8.6 | 31.1,15.7 33,13.8 33,7.55 33,7.5 U$30.P$1 31.5,6.05 28.95,8.6 27.45,10.1 25.2,10.1 24.9,9.8 23.55,8.45 23.55,8.4
  Top 1.27: 9.15,25.89 9.15,25.25 9.45,24.95 12.6,24.95 14.85,24.95 v15.45,25.55
  Bottom 0.254: 12.6,69.1 12.6,71.15 12.6,71.3 12.68,71.38 | U$24.2 9.7,71.45 v10.1,71.05 12.1,71.05 12.35,71.05 12.68,71.38 | U$20.2 U$19.2 10.5,63.8 U$18.2 10.5,62.15 10.13,61.78 | U$8.7 9.84,61.49 10.13,61.78 | v10.2,61.7 10.13,61.78 | 17.93,62.53 17.93,62.38 17.55,62 | 21.48,36.8 POSCON.P$7 | U$46.3 6.88,41.52 C14.2 6.95,42.15 6.95,42.45 v6.9,42.5 | v30.15,40.85 30.15,41 | U$45.3 13.63,69.1 12.6,69.1 | C13.2 12.05,67.6 12.6,68.15 12.6,69.1 | 12.68,71.38 13.05,71.75 13.2,71.9 17.4,71.9 v17.85,71.45 | v4.07,50.45 4.07,54.37 v4.35,54.65 | v25.2,32 24.97,32.23 arc45 24.79,32.3 24.45,32.3 | v17.4,61.7 17.25,61.7 17.18,61.78 | 25.49,63.4 25.25,63.4 arc-90 v23.5,65.15 | JP2.2 9.7,1.65 10.7,0.65 28.1,0.65 30.3,2.85 30.3,3.95 31.1,4.75 31.1,5.6 U$30.P$1
  Bottom 0.813: v23.5,65.15 23.5,64 | SCANNER.P$2 19.43,59.17 19.02,59.17 18.45,59.75 16.8,61.4 | 21.48,36.8 18.6,36.8 18,36.8 17.85,36.65 v17.85,35.75 17.85,35.45 18,35.3 19.05,34.25 v19.35,34.25 20.55,33.05 22.2,33.05 23.7,31.55 | POSCON.P$7 24.02,36.83 24.05,36.8 24.65,37.4 24.65,42.8 24.35,43.1 24.27,43.17 POSCON.P$2
  Bottom 1.016: U$9.P$2 31.6,68.9 31.6,74.55 28.7,77.45 15.6,77.45 14,79.05 3.8,79.05 2.56,79.05 JP1.2
  Bottom 1.27: 26.62,64.53 27.45,63.71 27.45,61.1 27.45,60.35 27.9,59.9 27.9,53 27.9,45.05 30.15,42.8 30.15,42.35 30.15,41 v30.15,40.85 30.15,36.95 28.5,35.3 28.5,33.35 28.5,33.2 27.6,32.3 26.1,32.3 | v15.45,25.55 16.65,25.55 18.75,25.55 19.35,26.15 21.3,28.1 21.3,29.15 23.7,31.55 24.15,32 24.45,32.3 26.1,32.3 | 24.75,32.3 26.1,32.3
  Bottom 2.184: U$44.P$1 11.5,54.2 13.8,56.5 13.8,58.4 16.4,61 | 16.5,61.1 16.8,61.4 17.1,61.7 17.18,61.78 17.93,62.53 18.8,63.4 25.49,63.4 26.62,64.53 26.68,64.53 27.15,65 28.35,65 31.05,67.7 31.2,67.85 U$9.P$2 | 16.5,61.1 16.4,61 | 16.4,61 16.5,61.1
  other vias: 11.5,51.7 10.6,53.7 11.5,53.7 12.4,53.7 10.6,52.7 11.5,52.7 12.4,52.7 10.6,51.7 12.4,51.7 10.6,50.7 11.5,50.7 12.4,50.7 11.5,49.7
  pour Top (no thermals): 8.1,54.8 14.85,54.8 14.85,54.5 13.5,54.5 13.51,48.8 14.86,48.8 14.85,48.65 15.3,48.65 15.3,48.05 17.55,48.05 17.55,46.7 8.55,46.7 8.55,48.35 8.1,48.35 8.1,48.8 9.6,48.8 9.6,54.5 8.1,54.5
N$1  (via drill 0.25)
  Top 0.254: U$2.P$13 8.05,77.75 8.05,77.8 7.4,78.45 7.2,78.45 4.5,78.45 3.9,77.85 3.9,75.7 3.6,75.4 1.05,72.85 | 1.05,72.7 1.05,72.85 | 1.05,72.85 1.05,72.7 | 1.05,72.7 1.05,62.45 1.05,57.95 v1.2,57.8 | U$14.P$13 27.8,42.75 27.35,42.75 27.3,42.8 27.3,43.4 27,43.7 23.85,43.7 22.8,43.7 21,41.9 20.4,41.3 17.25,41.3 16.95,41.6 15.9,41.6 15.3,41 10.95,41 9.6,42.35 9.15,42.8 9.15,43.1 8.55,43.7 6.9,43.7 6.15,42.95 6.15,41 5.55,40.4 5.4,40.25 5.25,40.1 4.65,40.1 4.5,39.95 3.3,38.75 2.7,38.15 2.7,33.5 2.7,33.2 3.45,32.45 3.45,31.25 v4.05,30.65 | U$10.P$14 16.75,12.15 18.45,13.85 21.45,13.85 23.55,15.95 23.55,19.4 24.45,20.3 v24.45,20.75 24.45,24.2 27.3,27.05 27.4,27.15 U$3.P$2 | v10.8,16.85 12.6,18.65 v17.55,18.65 | 1.05,72.85 1.05,72.7
  Bottom 0.254: v1.2,57.8 1.2,22.85 1.2,22.1 6,17.3 6.45,16.85 v10.8,16.85 10.8,18.35 10.8,22.7 4.05,29.45 v4.05,30.65 | v17.55,18.65 16.95,18.05 16.95,16.7 17.25,16.4 18.9,16.4 19.5,17 21.3,17 24.45,20.15 v24.45,20.75
N$2
  Top 0.254: U$10.P$12 17.25,11.9 18.75,13.4 22.05,13.4 24.15,15.5 24.15,18.75 25.25,19.85 25.25,22 27.75,24.5 27.86,24.61 U$3.P$6
N$3
  Top 0.254: U$10.P$10 17.75,11.8 18.75,12.8 22.2,12.8 24.9,15.5 24.9,17.4 26.15,18.65 26.15,21.85 27.6,23.3 27.64,23.34 U$3.P$8
N$4  (via drill 0.25)
  Top 0.254: v26,17.15 26,15.55 22.8,12.35 18.95,12.35 18.3,11.7 18.25,11.65 U$10.P$8 | v25.95,24.55 27.28,25.88 U$3.P$4
  Bottom 0.254: v26,17.15 25.95,17.2 v25.95,24.55
N$5  (via drill 0.25)
  Top 0.254: U$1.P$4 4.48,71.28 4.65,71.45 4.65,73.85 4.35,74.15 v3.8,74.15
  Bottom 0.254: U$8.9 3.81,62.76 4.1,63.05 4.1,63.1 4.1,69.35 4.1,70.2 4.05,70.25 3.8,70.5 v3.8,74.15
N$6
  Top 0.254: 26.9,11.75 26.9,21.4 27.57,22.07 U$3.P$10 | U$10.P$6 18.75,11.35 19.05,11.65 19.15,11.65 22.65,11.65 26.9,11.65 26.9,11.75 | 26.9,11.75 26.9,11.7 28.35,10.25 31.25,10.25 U$30.P$2
N$7  (via drill 0.25)
  Top 0.254: v15.3,55.7 15.3,55.85 14.7,56.45 14.7,58.55 15,58.85 15.07,58.92 U2.7
  Bottom 0.254: v15.3,55.7 17.55,55.7 18.3,54.95 18.3,54.35 18.6,54.05 21.46,54.05 SCANNER.P$6
N$8  (via drill 0.25)
  Top 0.254: U$1.P$3 2.43,72.72 2.1,72.4 2.1,60.85 v1.95,60.7
  Bottom 0.254: U$8.8 2.7,61.45 v1.95,60.7
N$9  (via drill 0.25)
  Top 0.254: U$1.P$1 6.4,70.05 4.5,68.15 2.7,66.35 2.7,60.35 2.1,59.75 v2.1,59.65
  Bottom 0.254: v2.1,59.65 1.7,59.65 1.1,60.25 1.1,63.7 1.4,64 2.6,64 2.67,64 U$8.10
N$10  (via drill 0.25)
  Top 0.254: v16.8,70.7 16.8,71 16.8,71.3 17.7,72.2 22.35,72.2 24.15,74 U$26.P$5 24.15,78.2 24.15,78.35 25.2,79.4 29.4,79.4 30.6,78.2 30.6,76.4 32.55,74.45 32.55,73.85 33,73.4 33.6,73.4 v33.75,73.25 | v13.95,71.15 13.8,71 13.8,67.1 13.5,66.8 12.9,66.8 12.6,66.5 12.6,65.77 U2.12 | U$10.P$21 14.75,1.95 v14.85,1.85
  Bottom 0.254: v13.95,71.15 16.35,71.15 v16.8,70.7 | v14.85,1.85 14.85,1.55 15.3,1.1 21.6,1.1 22.35,1.85 22.35,8.9 14.83,16.42 14.71,16.54 14.71,23.59 15.46,24.35 19.5,24.35 22.35,27.2 22.35,27.95 22.35,28.7 22.8,29.15 24.9,31.25 26.25,31.25 28.2,31.25 29.55,32.6 29.55,32.75 29.55,35 30.9,36.35 31.05,36.35 31.65,36.35 32.25,36.95 32.25,43.1 31.65,43.7 30.6,43.7 29.25,45.05 29.25,48.65 29.1,48.8 29.1,50.15 30.6,51.65 30.6,60.05 29.7,60.95 29.7,63.5 30.6,64.4 30.9,64.4 32.4,64.4 33,65 34.35,66.35 34.35,70.55 34.35,72.65 v33.75,73.25
N$11  (via drill 0.25)
  Top 0.254: U$10.P$35 11.25,3.7 11.1,3.55 7.6,3.55 6.45,4.7 6.45,12.35 3.45,15.35 v3.45,25.25
  Bottom 0.254: U$8.1 5.91,69.11 5.1,68.3 5.1,68 5.1,59.75 5.1,59 2.55,56.45 2.55,28.7 2.55,26.3 3.45,25.4 v3.45,25.25
N$12  (via drill 0.25)
  Top 0.254: U2.14 9.99,63.41 10.95,62.45 16.8,62.45 19.5,62.45 20.25,61.7 20.25,61.1 19.65,60.5 18.6,60.5 v17.25,59.15
  Bottom 0.254: v17.25,59.15 17.25,58.7 18.45,57.5 18.45,57.05 18.9,56.6 21.46,56.6 SCANNER.P$4
N$13
  Bottom 0.254: U$8.6 7.96,62.7 U$18.1
N$14
  Bottom 0.254: U$8.5 7.98,63.95 U$19.1
N$15
  Bottom 0.254: U$8.4 U$20.1
N$16  (via drill 0.25)
  Top 0.254: v3.6,27.05 2.85,27.05 2.1,26.3 2.1,14.75 6,10.85 6,4.4 7.35,3.05 11.2,3.05 11.55,3.4 | 11.55,3.4 11.7,3.55 | U$10.P$33 11.75,3.6 11.55,3.4
  Bottom 0.254: U$8.2 6.29,67.84 5.55,67.1 5.55,59.75 5.55,59.6 7.05,58.1 7.05,56.6 6.3,55.85 3.6,55.85 3,55.25 3,27.35 3.3,27.05 v3.6,27.05
N$17  (via drill 0.25)
  Top 0.254: U3.1 4.85,39.41 4.05,38.6 3.45,38 3.45,34.1 v4.05,33.5 | U$10.P$15 16.25,3.6 16.25,3.44 v16.64,3.05
  Bottom 0.254: v4.05,33.5 4.95,33.5 5.7,32.75 5.7,30.05 12.15,23.6 12.15,14.9 16.64,10.41 16.64,10.28 v16.64,3.05
N$18
  Top 0.254: U$11.2 9.99,59.09 U2.3
N$19  (via drill 0.25)
  Top 0.254: v16.5,38.65 14.35,38.65 U$16.2 13.3,38.4 13.2,38.3 13.04,38.13 U3.7
  Bottom 0.254: POSCON.P$4 18.68,40.63 17.1,39.05 16.9,39.05 v16.5,38.65
N$20  (via drill 0.25)
  Top 0.254: U3.6 13.57,36.87 U$16.1 15.3,37.4 15.9,38 17.1,38 v17.7,38.6
  Bottom 0.254: POSCON.P$5 18.46,39.37 v17.7,38.6
N$21
  Top 0.254: U$12.2 12.54,58.53 U2.5
N$22
  Top 0.254: U2.6 13.8,58.56 U$23.1
N$23
  Top 0.254: U$22.1 8.6,57.15 7.95,57.8 6.6,59.15 6.6,59.45 6.6,60.8 6.6,61.1 6.9,61.4 8.4,61.4 8.73,61.08 U2.2
N$24  (via drill 0.25)
  Top 0.406: 20.55,35.3 U$5.1
  Top 0.813: v20.55,34.7 20.55,35.3
  Bottom 0.254: 21.5,35.6 POSCON.P$8
  Bottom 0.813: 21.5,35.6 24.7,35.6 25.8,36.7 25.8,43.3 24.66,44.45 POSCON.P$1 | v20.55,34.7 U$5.1 21.46,35.6 POSCON.P$8
N$25  (via drill 0.25)
  Top 0.406: U$4.1 24.9,61.55
  Top 0.813: 24.9,61.55 v24.9,60.65
  Bottom 0.813: SCANNER.P$1 24.7,60.44 v24.9,60.65
N$26  (via drill 0.25)
  Top 0.254: U$10.P$19 15.25,2.5 v15.9,1.85 | v22.95,34.25 22.05,34.25 21,33.2 20.25,33.2 18.6,31.55 18.6,24.05 18.9,23.75 18.9,22.4 17.85,21.35 17.7,21.2 7.95,21.2 6.45,19.7 6.45,16.85 v8.7,14.6 | U$26.P$2 25.65,74.75 25.5,74.6 25.35,74.45 25.05,74.45 24.75,74.15 24.75,73.7 v23.7,72.65 | v18.5,74.1 17.05,74.1 17,74.05 14.85,71.9 14.85,70.1 14.4,69.65 14.4,66.95 13.8,66.36 U2.11 13.8,64.84 14.7,63.95 18.15,63.95 18.75,63.35 20.85,63.35 21.6,62.6 21.6,58.7 23.25,57.05 24.75,55.55 v24.75,54.2
  Bottom 0.254: v23.7,72.65 22.65,73.7 22.1,74.25 19.2,74.25 18.65,74.25 v18.5,74.1 | v22.95,34.25 23.4,34.7 23.85,34.7 24.9,34.7 25.35,35.15 27,36.8 27,43.1 25.05,45.05 24.75,45.35 v24.75,54.2 | v15.9,1.85 15,2.75 15,3.35 15,8.9 9.3,14.6 v8.7,14.6
N$27  (via drill 0.25)
  Top 0.254: U3.4 6.23,34.63 6.23,34.03 v4.35,32.15 | U$10.P$17 15.75,3.35 15.75,3.05 v16.95,1.85
  Bottom 0.254: 15.75,10.1 15.75,9.65 | 15.75,9.65 15.75,3.8 15.75,3.05 v16.95,1.85 | v4.35,32.15 4.95,31.55 4.95,29.75 11.55,23.15 11.55,14.3 15.75,10.1 | 15.75,10.1 15.75,9.65
N$28  (via drill 0.25)
  Top 0.254: U3.2 U3.3 4.71,36.87 4.5,36.65 v4.5,34.4 | 18.75,3.35 v18.9,3.35 18.75,3.35 | U$10.P$5 18.75,3.35
  Bottom 0.254: v18.9,3.35 18.9,8.9 12.75,15.05 12.75,23.9 6.6,30.05 6.6,33.65 5.85,34.4 v4.5,34.4
N$29  (via drill 0.25)
  Top 0.254: U$2.P$2 13.55,74.5 13.6,74.45 14.4,74.45 14.7,74.15 15.6,74.15 15.75,74.15 v16.15,74.55 | U$10.P$26 13.75,13.35 15,14.6 15,16.1 16.8,17.9 18,17.9 18.45,18.35 v18.75,18.35 | v28.05,69.5 28.05,67.25 32.55,62.75 32.55,61.55 32.55,38 31.95,37.4 31.8,37.25 U$14.P$2 27.9,37.25 27.75,37.25 27.6,37.1 27.6,31.85 27.6,31.25 v26.85,30.5
  Bottom 0.254: v28.05,69.5 28.05,69.8 26.7,71.15 26.4,71.45 24.6,71.45 24.45,71.6 24.45,72.05 24.45,72.8 22.5,74.75 16.7,74.75 16.35,74.75 v16.15,74.55 | v18.75,18.35 19.8,19.4 22.2,21.8 23.4,23 23.4,28.85 24.75,30.2 25.35,30.8 26.55,30.8 v26.85,30.5
N$30  (via drill 0.25)
  Top 0.254: U$2.P$1 14.05,75.05 14.85,75.05 14.95,75.05 v15.15,74.85 | v25.2,72.2 25.65,72.2 26.7,71.15 27,70.85 27.3,70.55 28.05,70.55 28.8,69.8 28.8,67.25 33.3,62.75 33.3,61.7 33.3,37.7 32.35,36.75 U$14.P$1 28.4,36.75 28.35,36.7 28.35,32.3 28.35,31.7 v28.95,31.1 | U$10.P$24 14.25,12.95 15.45,14.15 15.45,15.95 16.65,17.15 v18.15,17.15
  Bottom 0.254: v25.2,72.2 25.2,72.95 22.9,75.25 22.8,75.25 15.9,75.25 15.65,75.25 15.55,75.25 v15.15,74.85 | v18.15,17.15 18.6,17.6 20.4,17.6 23.55,20.75 23.55,21.2 24.9,22.55 24.9,26.9 28.95,30.95 v28.95,31.1
N$31  (via drill 0.25)
  Top 0.254: U$2.P$3 13.05,77.45 13.2,77.6 13.2,78.35 13.35,78.5 v17.4,78.5 | U$10.P$22 14.75,12.7 16.05,14 16.05,15.2 17.25,16.4 18.75,16.4 19.95,17.6 v19.95,18.5 | v25.65,29.9 25.65,31.4 27,32.75 27,37.25 27.5,37.75 U$14.P$3 31.25,37.75 31.95,38.45 31.95,59.75 31.95,60.2 v28.8,63.35
  Bottom 0.254: v25.65,29.9 24,28.25 24,22.55 22.8,21.35 22.8,20.9 20.4,18.5 v19.95,18.5 | v28.8,63.35 28.95,63.35 30.6,65 31.65,65 32.4,65.75 33.75,67.1 33.75,69.8 32.7,70.85 32.7,74 34.4,75.7 34.4,78.65 33.6,79.45 29.9,79.45 18.35,79.45 v17.4,78.5
N$32  (1 unrouted)
  Top 0.254: 20.2,54.4 20.2,55.77 20.23,55.8 | U$44.16 U$44.15 14.4,51.39 14.4,51.7 | C15.1 16.6,52.35 16.5,52.25
  Top 1.27: 14.4,51.7 15.2,51.7 15.8,51.7 16.35,52.25 16.5,52.25 18.05,52.25
  Top 1.778: 18.05,52.25 20.2,54.4
N$33
  Top 0.254: U$2.P$4 12.55,74.4 12.45,74.3 12,74.3 U$25.1
N$34
  Top 0.254: U$2.P$8 10.55,74.5 10.2,74.15 10.2,72.2 10.6,71.8 10.6,71.55 11.35,70.8 U$6.1
N$35  (1 unrouted)
  Top 0.254: U$44.13 U$44.12 14.39,49.45 14.39,49.74 | 16.7,49.5 16.7,49.63 16.64,49.69 | 16.64,49.69 16.59,49.74 | C16.1 16.85,49.9 16.64,49.69
  Top 1.27: 14.39,49.74 16.59,49.74
  Top 1.778: 16.7,49.5 18.5,49.5 19.3,50.3 20.2,50.3 22.3,52.4 22.45,52.4 28.25,52.4 29.17,53.32 29.17,55.8
N$36
  Top 0.254: U$44.14 17.02,50.73 C16.2
N$37
  Top 0.254: U$44.17 15.27,52.67 16.05,53.45 16.1,53.5 C15.2
N$38
  Top 0.254: C3.2 C2.2 7.8,54.2 7.95,54.05 8.02,53.98 U$44.2
N$39  (via drill 0.25)
  Top 0.254: U$10.P$11 17.25,2.45 17.55,2.15 18.15,1.55 18.6,1.55 18.9,1.55 23.1,1.55 23.55,2 v23.85,2 | v18.15,23.3 18.15,31.85 19.95,33.65 20.7,33.65 21.45,34.4 21.45,36.65 21.3,36.8 21.2,36.9 U$5.3
  Bottom 0.254: v18.15,23.3 18.15,20.6 16.35,18.8 16.35,16.4 16.95,15.8 19.35,15.8 19.8,16.25 19.95,16.4 21.15,16.4 23.7,13.85 24.9,12.65 24.9,5.15 24.9,3.35 24.6,3.05 23.85,2.3 v23.85,2
N$40  (via drill 0.25)
  Top 0.254: U$4.3 27.65,61.8 31.35,58.1 31.35,52.55 31.35,51.05 v29.85,49.55 | U$10.P$16 16.25,12.4 18.15,14.3 21.15,14.3 22.95,16.1 22.95,20 23.55,20.6 23.55,24.35 27.3,28.1 29.4,28.1 29.7,28.4 v29.85,28.55
  Bottom 0.254: v29.85,49.55 29.85,49.1 29.85,45.2 30.6,44.45 31.95,44.45 32.85,43.55 32.85,36.35 32.1,35.6 31.95,35.6 30.75,35.6 30,34.85 30,34.7 30,29.6 30,28.7 v29.85,28.55
N$41  (via drill 0.25)
  Top 0.254: U$26.P$10 21.65,74.5 20.55,73.4 20.4,73.4 17.25,73.4 16.8,72.95 15.45,71.6 15.45,69.8 15.07,69.42 U2.10 15.07,64.78 15.3,64.55 18.45,64.55 19.05,63.95 21.45,63.95 22.35,63.05 22.35,59 23.1,58.25 24.15,57.2 25.5,55.85 v25.5,55.25 | U$10.P$25 13.75,3.4 13.75,2.8 13.75,2.7 v12.9,1.85 | v24.45,33.95 23.7,33.95 23.25,33.5 22.05,33.5 21.15,32.6 20.55,32.6 19.2,31.25 19.2,24.35 19.5,24.05 19.5,22.1 18.15,20.75 18,20.6 8.4,20.6 7.2,19.4 7.2,17.45 9.45,15.2 9.45,13.7 v8.7,12.95
  Bottom 0.254: v12.9,1.85 12.6,1.85 12.45,2 12.45,6.8 8.25,11 8.25,12.5 v8.7,12.95 | v25.5,55.25 25.5,54.2 25.5,45.35 27.6,43.25 27.6,36.65 24.9,33.95 v24.45,33.95
N$42
  Top 0.254: C3.1 6.1,55.25 R2.1
N$43  (via drill 0.25)
  Top 0.254: R1.2 17.1,54.4 17.05,54.35 | U$44.18 15.18,53.33 16.05,54.2 16.2,54.35 17.05,54.35 | 17.05,54.35 17.4,54 v17.5,54
  Top 0.406: v20.3,48.8 20.3,47.95 C1.1
  Top 0.813: D1.C 22.1,46.15 C1.1
  Bottom 0.406: v20.3,48.8 16.8,48.8 16.4,49.2 16.4,49.3 16.4,52.9 v17.5,54
N$44
  Top 0.254: U$44.19 15.07,53.98 R1.1
N$45  (via drill 0.25)
  Top 0.254: R3.1 R5.2 3.1,53.7 4.5,53.7 v4.9,53.3 5.25,53.65 R2.2 6.1,54.25 C2.1 6.15,53.9 6.45,53.6 7.65,53.6 7.93,53.33 U$44.3 | R4.1 6.2,48.4 v6.3,48.5
  Bottom 0.254: v6.3,48.5 6.3,48 6.3,47.7 4.7,47.7 4.3,48.1 4.3,49 4.7,49.4 4.7,49.5 4.7,52.5 4.7,53.1 v4.9,53.3
N$46
  Top 0.254: C4.2 3.8,47.55 3.5,47.55 3.3,47.55 3.1,47.55 2.25,47.55 1.7,48.1 1.7,51.5 1.7,51.8 1.7,51.9 R3.2
N$47  (via drill 0.25)
  Top 0.254: v6.3,51.7 6.2,51.6 6.2,51.1 5.85,50.75 5.7,50.75 5.55,50.6 5.3,50.35 R9.2 | U$44.5 U$44.6 8.58,51.68 8.6,51.7 | C10.2 16.95,45.5 16.8,45.35 v16.8,44.5 | v16.2,45.1 15.6,44.5 C9.2
  Top 1.016: v7.1,51.3 v7.1,52.2 arc-60 v6.3,51.7
  Top 1.27: 8.6,51.7 v6.3,51.7 | 16.95,45.5 15.9,44.45 14.55,44.45
  Bottom 0.254: 17.54,65.93 17.13,65.93 17.1,65.9 | R13.2 17.85,67.45 17.85,66.1
  Bottom 1.016: 7,51.7 7,52.1 arc-60 v7.1,51.3
  Bottom 1.27: 6.9,51.7 v6.3,51.7 6.9,51.7 | 6.9,51.7 7,51.7 | 6.9,51.7 8.3,50.3 8.9,49.7 8.9,47.3 9.2,47 14.3,47 v16.2,45.1 v16.8,44.5
  Bottom 2.184: v7.1,51.3 8.1,52.3 8.1,54.8 10.8,57.5 10.8,59.19 11.01,59.4 17.54,65.93 17.71,66.1 17.85,66.1 R10.2
N$48  (via drill 0.25)
  Top 0.254: 7.4,48.1 v7.4,47.6 | 7.4,46.6 7.3,46.7 v7.2,46.7
  Top 0.61: 7.4,48.1 7.4,48.95 7.88,49.42 U$44.9 | v7.4,47.6 7.4,46.9 7.4,46.7 | 7.4,46.6 6.3,46.6 6.25,46.55 R4.2 5.7,46.55 R7.1 C4.1
  Top 0.813: D1.A 18.65,44.5 17.1,42.95 11.85,42.95 11.4,43.4 11.4,44.4 C7.1
  Top 1.27: v7.4,47.6 7.4,46.9 v7.2,46.7 8.25,45.65 C6.2 10.15,44.5 C7.1
  Bottom 0.254: 11.25,45.15 11.7,45.15 | 11.7,45.15 R11.2 12.2,45.3 12.2,45.5 | R15.2 10.4,43.85 11.7,45.15
  Bottom 1.27: v7.4,47.6 7.4,46.9 v7.2,46.7 7.2,46.4 8.1,45.5 12.2,45.5
N$49  (via drill 0.25)
  Top 0.254: C5.2 R6.2 5.25,52.3 v5.95,53 7.35,53 7.65,53 7.8,52.85 7.98,52.67 U$44.4 | R7.2 v5.2,48.6
  Bottom 0.254: v5.2,48.6 5.25,48.65 5.25,48.8 5.25,52.25 5.25,52.3 v5.95,53
N$50
  Top 0.254: U$44.7 7.93,50.73 7.8,50.6 7.5,50.6 7.05,50.15 6.95,50.05 R9.1
N$51
  Top 0.254: R8.1 C8.2 3.95,49.25 6.75,49.25 7.57,50.08 U$44.8
N$52  (via drill 0.25)
  Top 0.254: v19.35,61.4 18.45,61.4 17.25,60.2 16.45,60.2 U2.8
  Bottom 0.254: SCANNER.P$5 24.41,55.36 24.9,55.85 24.9,58.55 26.1,59.75 26.1,61.25 25.65,61.7 19.65,61.7 v19.35,61.4
N$53
  Bottom 0.254: 16.35,69.5 16.35,69.65 15.63,70.38 U$45.1 | 16.35,69.5 C11.1 | R12.1 16.35,69.5
N$54  (via drill 0.25)
  Top 0.254: U$26.P$6 23.65,74.35 23.65,74.25 22.2,72.8 17.4,72.8 16.05,71.45 16.05,67.4 16.35,67.1 U2.9 18.05,65.7 19.35,64.4 21.9,64.4 22.95,63.35 22.95,59.6 24.15,58.4 26.4,56.15 v26.4,55.85 | U$10.P$23 14.25,2.6 14.25,2.3 14.25,2.15 v13.95,1.85 | v25.65,33.5 24.9,33.5 24.45,33.05 22.5,33.05 21.45,32 20.85,32 19.8,30.95 19.8,24.65 20.1,24.35 20.1,21.8 18.3,20 8.85,20 8.1,19.25 8.1,17.6 10.2,15.5 10.2,12.05 v9.45,11.3
  Bottom 0.254: v26.4,55.85 26.4,45.05 28.65,42.8 28.65,40.85 28.65,36.95 25.65,33.95 v25.65,33.5 | v9.45,11.3 9.45,11.15 10.05,10.55 10.35,10.55 13.2,7.7 13.2,3.2 13.95,2.45 v13.95,1.85
N$55
  Bottom 0.254: R13.1 17.45,68.5 17.25,68.3 16.75,67.8 C11.2 15.5,67.8 15,68.3 15,69.1 14.7,69.4 14.4,69.7 14.38,69.72 U$45.2
N$56
  Bottom 0.254: C12.1 9.05,41.35 9.05,39.65 | 9.05,40.25 9.05,39.65 | 9.05,39.65 R14.1 9,39.5 5.85,39.5 5.57,39.77 5.57,40.23 U$46.1
N$57
  Bottom 0.254: C12.2 8.95,42.45 R15.1 8.35,44.45 5.85,44.45 5.55,44.15 5.55,42.35 5.85,42.05 6.23,41.67 U$46.2
N$58  (via drill 0.25)
  Top 0.254: U$2.P$11 9.05,74.35 9.05,74.05 9.05,72.85 9.05,71.05 9.05,70.9 v10,69.95 | v11.25,67.55 10.5,67.55 10.2,67.55 9.45,67.55 8.85,68.15 7.05,68.15 6.15,67.25 6.15,66.05 v6.3,65.9 | U$14.P$11 26.85,41.75 26.4,42.2 26.4,42.65 26.25,42.8 24.3,42.8 23.4,42.8 21.45,40.85 20.7,40.1 v17.1,40.1 | v17.85,14.9 20.7,14.9 22.2,16.4 22.2,20.15 22.8,20.75 22.95,20.9 22.95,23.3 22.95,30.05 21.75,31.25 v21.45,31.25 | U$10.P$7 18.25,2.8 18.6,2.45 19.5,2.45 v20.1,3.05 21.45,4.4 v23.55,4.4
  Bottom 0.254: v6.3,65.9 6.3,65.6 6.15,65.45 6.15,59.9 7.65,58.4 7.65,56.45 6.6,55.4 5.4,55.4 3.9,55.4 3.6,55.1 3.45,54.95 3.45,44.3 3.45,41 3.45,39.95 4.8,38.6 6.6,38.6 6.75,38.45 6.88,38.33 U$46.6 6.9,37.83 6.9,36.95 7.1,36.75 R16.1 6.15,36.5 6,36.35 5.85,36.2 5.85,35.15 6.15,34.85 6.75,34.85 7.35,34.25 7.35,33.8 7.35,30.2 13.5,24.05 13.5,15.2 13.65,15.05 20.1,8.6 v20.1,3.05 | v11.25,67.55 11.4,67.55 11.7,67.85 11.85,68 11.85,68.75 11.6,69 11.52,69.08 U$45.6 10.32,69.08 10.2,69.2 10.2,69.75 v10,69.95 | v17.1,40.1 16.5,40.1 15.9,39.5 15.9,39.05 15.45,38.6 15.45,36.35 16.2,35.6 17.55,34.25 18,34.25 18.75,33.5 21,31.25 v21.45,31.25 | v17.85,14.9 23.55,9.2 v23.55,4.4
N$59  (via drill 0.25)
  Top 0.254: v4.65,41.75 1.2,45.2 1.2,55.55 3.15,57.5 3.15,59.6 3.15,60.5 3.15,61.1 4.05,62 4.05,65.6 5.1,66.65 5.1,67.7 6.15,68.75 7.5,68.75 8.7,68.75 9.45,68.75 v9.9,68.3 | U$10.P$9 17.75,2.55 18.3,2 20.4,2 v21,2.6 21.6,3.2 v23.7,3.2 | U$14.P$12 27.25,42.25 27.1,42.25 26.85,42.5 26.85,42.95 26.55,43.25 23.85,43.25 23.1,43.25 21.15,41.3 20.7,40.85 v16.35,40.85 | v20.25,15.65 21.45,16.85 21.45,20.6 22.2,21.35 22.2,29.45 21.3,30.35 v20.7,30.35 | U$2.P$12 8.55,70.25 v8.45,70.15
  Bottom 0.254: U$45.5 10.02,68.42 v9.9,68.3 9.6,68.6 9.6,69.35 9.3,69.65 9.3,69.95 9.1,70.15 v8.45,70.15 | v16.35,40.85 15.3,39.8 15.3,39.35 14.85,38.9 14.85,35.75 16.8,33.8 17.7,33.8 18.15,33.35 20.7,30.8 v20.7,30.35 | v23.7,3.2 24.3,3.8 24.3,4.85 24.3,11.6 v20.25,15.65 | 14.25,15.8 21.75,8.3 21.75,7.7 21.75,3.05 21.3,2.6 v21,2.6 | 14.25,15.8 14.24,15.8 | v4.65,41.75 4.65,39.65 5.25,39.05 7.05,39.05 7.5,38.6 7.52,38.58 U$46.5 7.52,37.7 8.05,37.17 R17.1 8.65,36.55 9.15,36.05 9.15,30.2 9.15,29.9 14.1,24.95 14.1,15.95 14.25,15.8
N$60  (via drill 0.25)
  Top 0.254: U$26.P$3 25.15,77.7 25.4,77.95 25.8,78.35 28.95,78.35 29.4,77.9 29.7,77.6 29.7,75.65 30.15,75.2 31.35,74 31.35,72.95 32.1,72.2 33.75,70.55 33.9,70.4 33.9,14.15 33.9,5.15 29.85,1.1 13.5,1.1 12.45,1.1 12.15,1.1 12.15,1.35 | U$10.P$27 13.25,3.25 12.15,2.15 12.15,1.35 | v12,1.35 12.15,1.35
  Bottom 0.254: U$38.1 8.8,3.35 | 8.8,3.35 10.6,3.35 11.5,2.45 11.5,1.95 11.5,1.85 v12,1.35 | 8.8,3.35 8.4,3.35 JP2.1
N$61  (via drill 0.25)
  Top 0.254: U$2.P$14 7.55,75.25 7.35,75.05 6.15,75.05 5.55,74.45 5.25,74.15 5.25,70.25 v4.95,69.95 | U$10.P$18 15.75,12.95 16.65,13.85 16.65,14.9 17.4,15.65 18.9,15.65 20.7,17.45 20.7,19.1 20.4,19.4 16.95,19.4 16.8,19.25 16.65,19.25 16.2,19.25 10.2,19.25 v9.75,18.8 | U$14.P$14 27.8,44.15 25.8,44.15 23.55,44.15 22.5,44.15 20.1,41.75 17.55,41.75 17.25,42.05 13.05,42.05 12.6,41.6 12.45,41.45 11.7,41.45 9.75,43.4 8.85,44.3 6.45,44.3 6.3,44.15 5.55,43.4 5.55,43.1 5.55,41.6 4.8,40.85 4.65,40.7 2.1,38.15 2.1,33.05 2.1,30.2 v3.75,28.55
  Bottom 0.254: 5.25,25.85 5.25,25 4,23.75 3,23.75 2.1,24.65 2.1,24.8 2.1,29 2.1,56.6 4.65,59.15 4.65,60.05 4.65,63.5 4.65,69.5 4.95,69.8 v4.95,69.95 | v9.75,18.8 9.75,21.35 5.25,25.85 | v3.75,28.55 5.25,27.05 5.25,25.85
N$62
  Top 0.254: U$26.P$4 24.65,77.95 24.65,78.1 25.35,78.8 29.25,78.8 30.15,77.9 30.15,76.1 31.8,74.45 31.95,74.3 31.95,73.55 34.5,71 34.5,14.6 34.5,5 30.15,0.65 13.2,0.65 11.85,0.65 11.3,0.65 11.1,0.85 11.1,1.85 12.75,3.5 U$10.P$29
N$63
  Top 0.254: U$14.P$4 27.55,38.25 27.25,38.25 26.25,37.25 25.2,36.2 24.3,36.2 22.65,36.2 22.35,36.5 22.35,37.1 22.35,40.1 23.55,41.3 U$28.1
N$64
  Top 0.254: U$14.P$8 27.6,40.25 27.45,40.25 27.15,39.95 27.15,39.5 26.85,39.2 26.8,39.15 U$27.1
N$65
  Bottom 1.016: JP1.1 2.5,76.45 2.7,76.65 U$15.P$2
R1IN  (via drill 0.25)
  Top 0.254: v18.5,58.45 20.85,60.8 20.85,62.15 20.1,62.9 12.9,62.9 11.4,64.4 11.27,64.53 U2.13
  Bottom 0.254: SCANNER.P$3 19.04,57.91 v18.5,58.45
V+
  Top 0.813: U$9.P$1 23.3,70.4 U$33.2 U$34.2 21,68.2 21.05,68.15 U$35.2
  Bottom 0.254: R12.2 19.1,70.5 R10.1
  Bottom 1.016: R10.1 19.15,72.85 16.5,72.85 12.5,72.85 9.4,75.95 U$15.P$1
  Bottom 2.184: R10.1 22,71.7 U$9.P$1
(copper drawn outside any net)
  shapes: Bottom area x1

### Text on the board
tPlace: - | + | R.S. 6/19/2015 | CHESCN.PCB.v1.0